# Altium project GBA.PrjPcb (part 1 of 4)
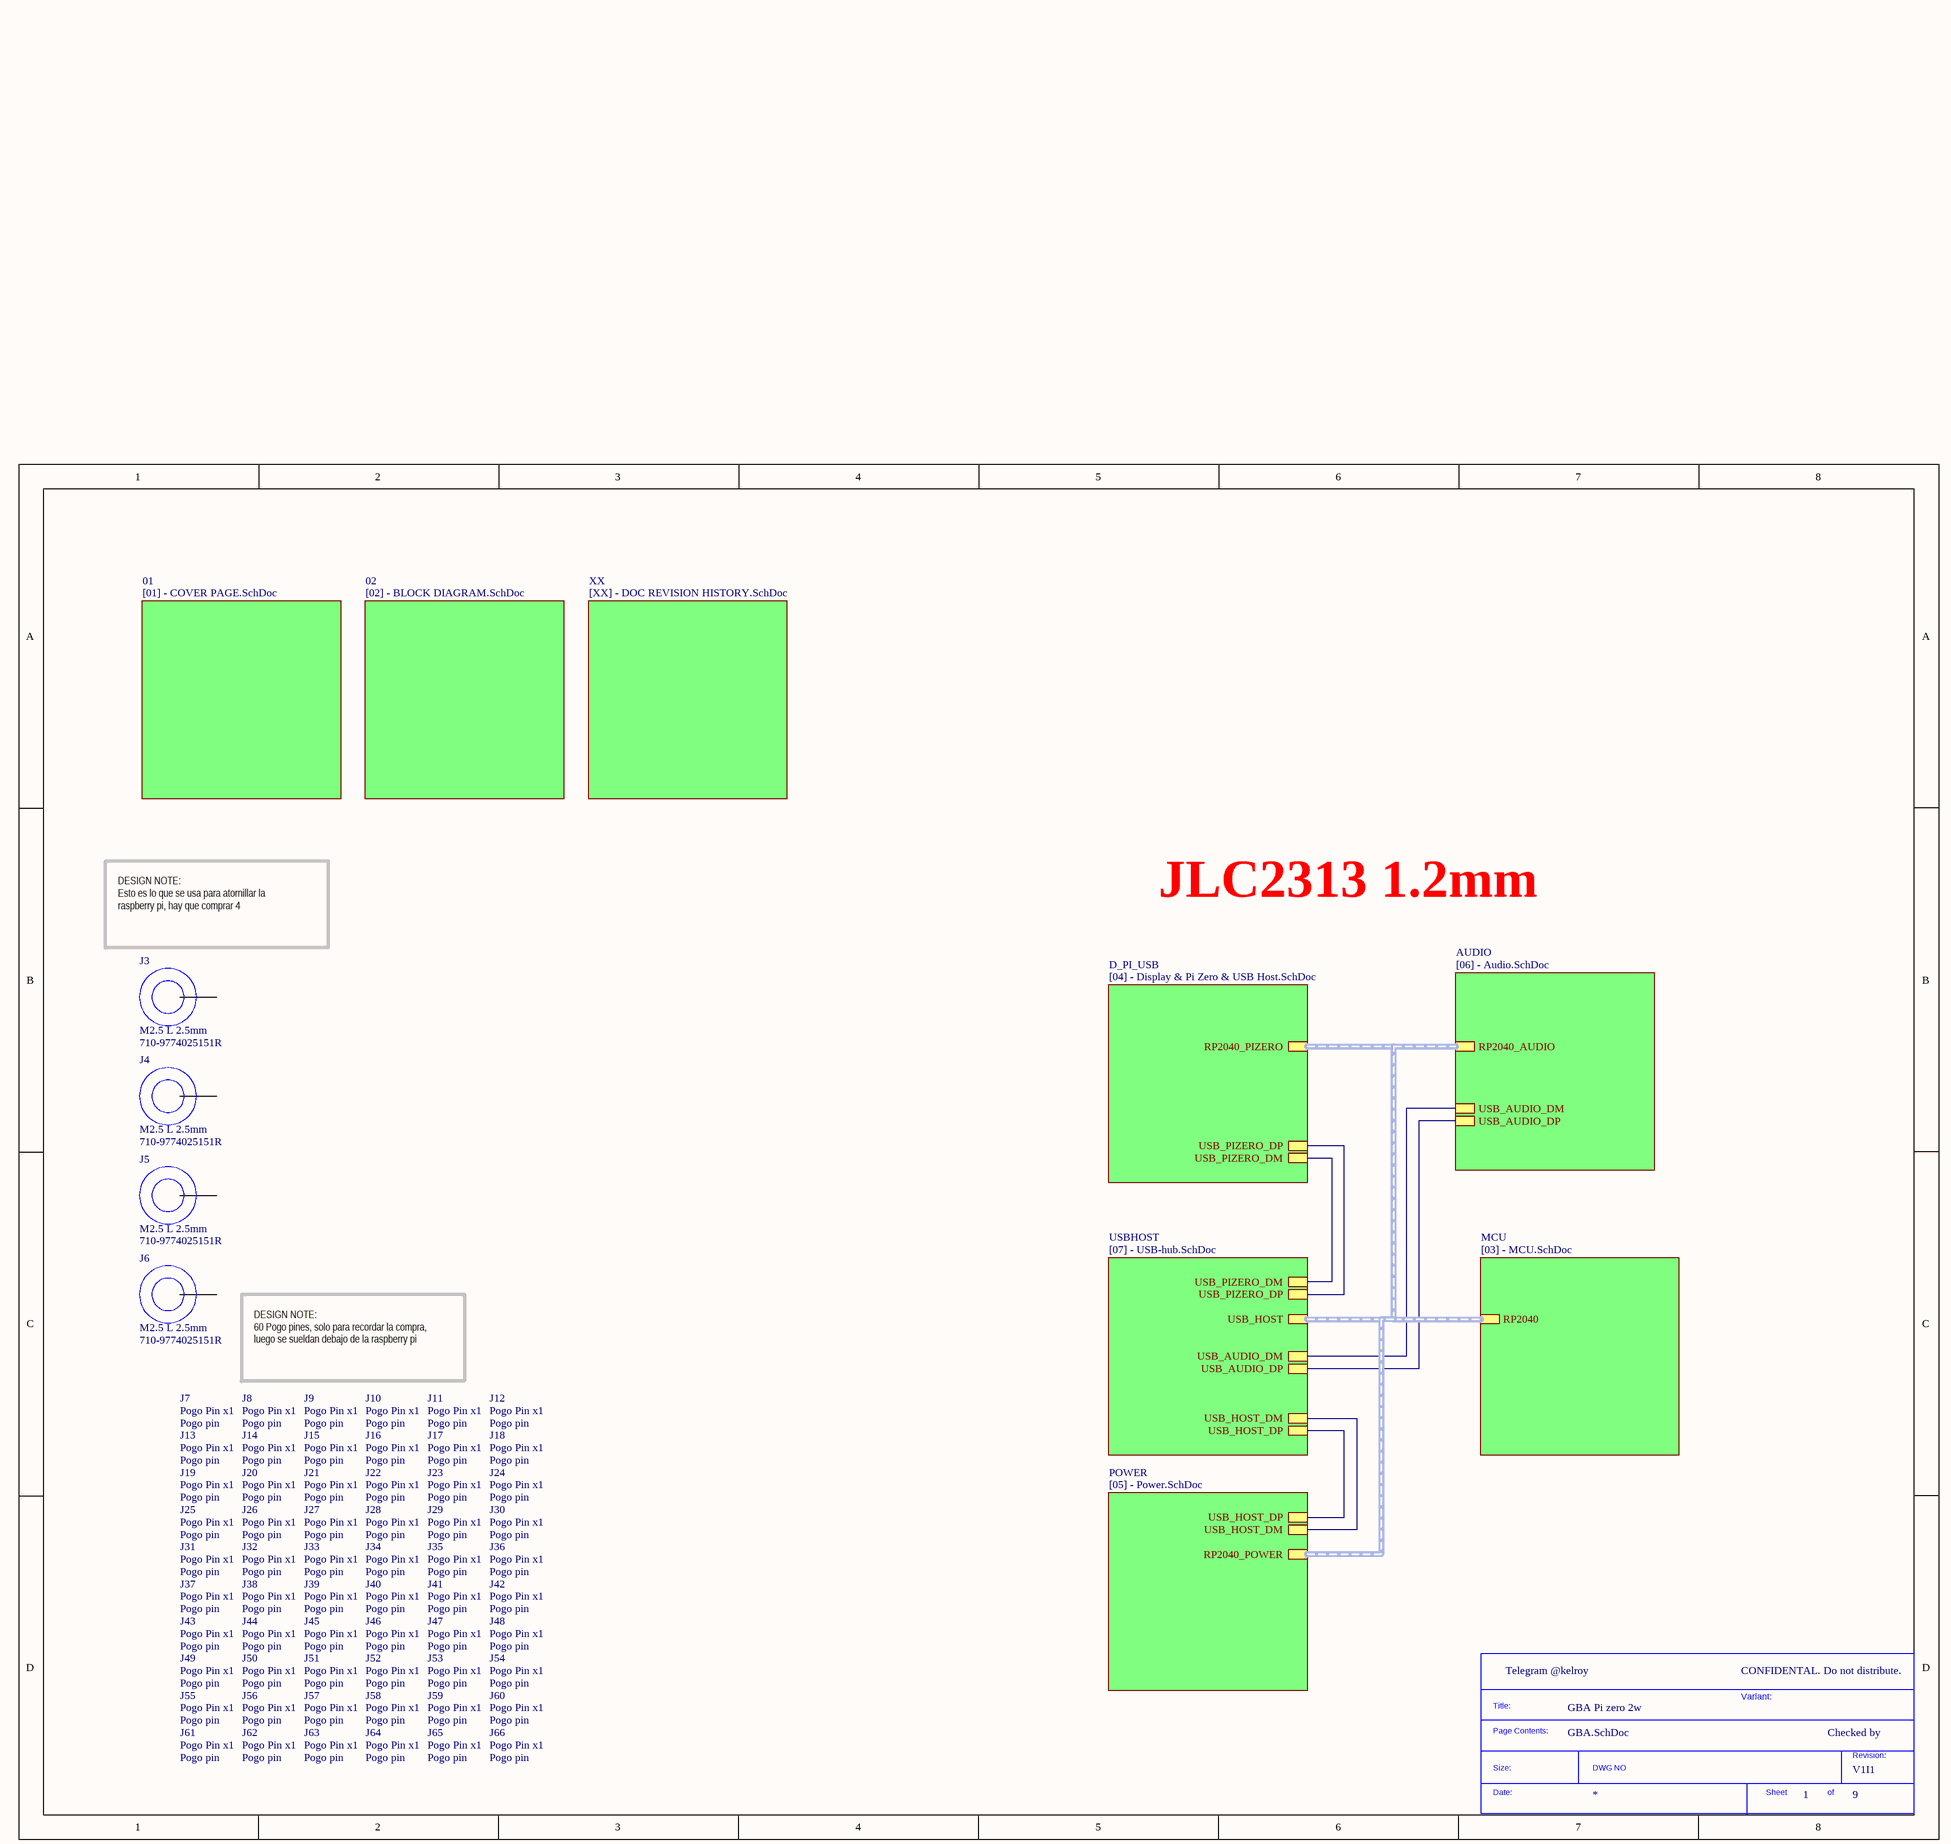
[diagram p0: GBA.SchDoc]
VersionRevision: V1I1; Project: GBA Pi zero 2w; Company: Telegram @kelroy
9 sheets, 258 parts. Net scope: hierarchical (ports join the sheet entries above them; power ports are global).
Board file: GBA_V1.PcbDoc
Sheets:
  GBA.SchDoc
    01 = [01] - COVER PAGE.SchDoc
    02 = [02] - BLOCK DIAGRAM.SchDoc
    XX = [XX] - DOC REVISION HISTORY.SchDoc
    D_PI_USB = [04] - Display & Pi Zero & USB Host.SchDoc
    USBHOST = [07] - USB-hub.SchDoc
    AUDIO = [06] - Audio.SchDoc
    MCU = [03] - MCU.SchDoc
    POWER = [05] - Power.SchDoc

## Sheet GBA.SchDoc
size A3; CompanyName: KDS; Organization: KDS; DocumentNumber: 4; Revision: V1I1; SheetNumber: 1; SheetTotal: 9; PageSetup: Record=PageOptions|CenterHorizontal=True|CenterVertical=True|PrintScale=1.07|XCorrection=1.00|YCorrection=1.00|PrintKind=1|BorderSize=5000000|LeftOffset=0|BottomOffset=0|Orientation=2|PaperLength=1000|PaperWidth=1000|Scale=100|PaperSource=7|PrintQuality=600|MediaType=1|DitherType=10|PaperKind=A3|PrintScaleMode=1; ProjectName: KDS C6A816x Module

### Parts
(Parts that share a designator on the sheet are numbered #1, #2 ... from top to bottom, then left to right.)
*#1  SDTitleBlock  (value not drawn)  (graphical)
J3  M2.5 L 2.5mm  Supplier Part Number 1: 710-9774025151R  (mechanical)
J4  M2.5 L 2.5mm  Supplier Part Number 1: 710-9774025151R  (mechanical)
J5  M2.5 L 2.5mm  Supplier Part Number 1: 710-9774025151R  (mechanical)
J6  M2.5 L 2.5mm  Supplier Part Number 1: 710-9774025151R  (mechanical)
J7  Pogo pin  (mechanical)
J8  Pogo pin  (mechanical)
J9  Pogo pin  (mechanical)
J10  Pogo pin  (mechanical)
J11  Pogo pin  (mechanical)
J12  Pogo pin  (mechanical)
J13  Pogo pin  (mechanical)
J14  Pogo pin  (mechanical)
J15  Pogo pin  (mechanical)
J16  Pogo pin  (mechanical)
J17  Pogo pin  (mechanical)
J18  Pogo pin  (mechanical)
J19  Pogo pin  (mechanical)
J20  Pogo pin  (mechanical)
J21  Pogo pin  (mechanical)
J22  Pogo pin  (mechanical)
J23  Pogo pin  (mechanical)
J24  Pogo pin  (mechanical)
J25  Pogo pin  (mechanical)
J26  Pogo pin  (mechanical)
J27  Pogo pin  (mechanical)
J28  Pogo pin  (mechanical)
J29  Pogo pin  (mechanical)
J30  Pogo pin  (mechanical)
J31  Pogo pin  (mechanical)
J32  Pogo pin  (mechanical)
J33  Pogo pin  (mechanical)
J34  Pogo pin  (mechanical)
J35  Pogo pin  (mechanical)
J36  Pogo pin  (mechanical)
J37  Pogo pin  (mechanical)
J38  Pogo pin  (mechanical)
J39  Pogo pin  (mechanical)
J40  Pogo pin  (mechanical)
J41  Pogo pin  (mechanical)
J42  Pogo pin  (mechanical)
J43  Pogo pin  (mechanical)
J44  Pogo pin  (mechanical)
J45  Pogo pin  (mechanical)
J46  Pogo pin  (mechanical)
J47  Pogo pin  (mechanical)
J48  Pogo pin  (mechanical)
J49  Pogo pin  (mechanical)
J50  Pogo pin  (mechanical)
J51  Pogo pin  (mechanical)
J52  Pogo pin  (mechanical)
J53  Pogo pin  (mechanical)
J54  Pogo pin  (mechanical)
J55  Pogo pin  (mechanical)
J56  Pogo pin  (mechanical)
J57  Pogo pin  (mechanical)
J58  Pogo pin  (mechanical)
J59  Pogo pin  (mechanical)
J60  Pogo pin  (mechanical)
J61  Pogo pin  (mechanical)
J62  Pogo pin  (mechanical)
J63  Pogo pin  (mechanical)
J64  Pogo pin  (mechanical)
J65  Pogo pin  (mechanical)
J66  Pogo pin  (mechanical)

### Sub-sheets
01 = [01] - COVER PAGE.SchDoc: no entries
02 = [02] - BLOCK DIAGRAM.SchDoc: no entries
AUDIO = [06] - Audio.SchDoc: USB_AUDIO_DM, RP2040_AUDIO (harness RP2040), USB_AUDIO_DP
D_PI_USB = [04] - Display & Pi Zero & USB Host.SchDoc: RP2040_PIZERO (harness RP2040), USB_PIZERO_DP, USB_PIZERO_DM
MCU = [03] - MCU.SchDoc: RP2040 (harness RP2040)
POWER = [05] - Power.SchDoc: RP2040_POWER (harness RP2040), USB_HOST_DM, USB_HOST_DP
USBHOST = [07] - USB-hub.SchDoc: USB_PIZERO_DM, USB_AUDIO_DP, USB_HOST_DM, USB_HOST (harness RP2040), USB_PIZERO_DP, USB_HOST_DP, USB_AUDIO_DM
XX = [XX] - DOC REVISION HISTORY.SchDoc: no entries

### Nets
POST_DR_DAC_N: sheet USBHOST/USB_AUDIO_DM, sheet AUDIO/USB_AUDIO_DM
POST_DR_DAC_P: sheet USBHOST/USB_AUDIO_DP, sheet AUDIO/USB_AUDIO_DP
RPI_USB_N: sheet D_PI_USB/USB_PIZERO_DM, sheet USBHOST/USB_PIZERO_DM
RPI_USB_P: sheet D_PI_USB/USB_PIZERO_DP, sheet USBHOST/USB_PIZERO_DP
USB_D2_N: sheet USBHOST/USB_HOST_DM, sheet POWER/USB_HOST_DM
USB_D2_P: sheet USBHOST/USB_HOST_DP, sheet POWER/USB_HOST_DP

Not connected (* = marked no-connect by the designer): J3 1; J4 1; J5 1; J6 1

### Buses and harness runs
harness sheet AUDIO/RP2040_AUDIO = sheet D_PI_USB/RP2040_PIZERO = sheet MCU/RP2040 = sheet POWER/RP2040_POWER = sheet USBHOST/USB_HOST

### Notes on the sheet
- JLC2313 1.2mm
- DESIGN NOTE:
  Esto es lo que se usa para atornillar la raspberry pi, hay que comprar 4
- DESIGN NOTE:
  60 Pogo pines, solo para recordar la compra, luego se sueldan debajo de la raspberry pi
- CONFIDENTAL. Do not distribute.
- Variant:
- Checked by
- (in symbol 0906-0-15-20-76-14-11-0) Pogo Pin x1
- (in symbol SDTitleBlock) Title:; Page Contents:; Revision:; Size:; DWG NO; Date:; Sheet; of

### Library data of the parts
J3-J6 = 9774025151R: Spacer Material: Steel Mounting: SMT Series: WA-SMSI Thread D: M2.5; Manufacturer: Wurth Electronics; Plating: Tin; Threaded/Unthreaded: Threaded; Outside Diameter: 0.201inch; Supplier 1: Mouser; Manufacturer Part Number: 9774025151R; RoHS: Yes; Category: Spacers, Standoffs; Stock 1: 24227; Pricing 1: 1=1,27000, 10=1,22000, 50=1,07000, 100=0,97900, 500=0,90700, 1000=0,90700, 10000=0,90700 (USD); Material: Steel; Length: 0.154inch; REACH SVHC: Unknown; ComponentLink1URL: http://www.farnell.com/datasheets/1960364.pdf?src-supplier=Farnell; ComponentLink1Description: http://www.farnell.com/datasheets/1960364.pdf?src-supplier=Farnell; ComponentLink2URL: http://www.mouser.com/ds/2/445/9774025151R-611453.pdf?src-supplier=Mouser; ComponentLink2Description: http://www.mouser.com/ds/2/445/9774025151R-611453.pdf?src-supplier=Mouser; ComponentLink3URL: https://media.digikey.com/pdf/Data%20Sheets/Wurth%20Electronics%20PDFs/WA-SMSx_Performance_Flyer.pdf?src-supplier=Digi-Key; ComponentLink3Description: https://media.digikey.com/pdf/Data%20Sheets/Wurth%20Electronics%20PDFs/WA-SMSx_Performance_Flyer.pdf?src-supplier=Digi-Key; ComponentLink4URL: http://www.farnell.com/datasheets/1960364.pdf?src-supplier=Element14; ComponentLink4Description: http://www.farnell.com/datasheets/1960364.pdf?src-supplier=Element14; ComponentLink5URL: http://www.farnell.com/datasheets/1960364.pdf?src-supplier=Newark; ComponentLink5Description: http://www.farnell.com/datasheets/1960364.pdf?src-supplier=Newark
J7-J66 = 0906-0-15-20-76-14-11-0: 0906 Series Spring-Loaded Pin Shell Material=Brass Alloy; Manufacturer: Mill-Max; Supplier 1: Mouser; Manufacturer Part Number: 0906-0-15-20-76-14-11-0; RoHS: Yes; Category: Connectors; Stock 1: 63461; Pricing 1: 1=0,56000, 10=0,42300, 50=0,42300, 100=0,37000, 500=0,35200, 1000=0,29000, 2500=0,25500, 10000=0,23400, 30000=0,22800, 50000=0,22000 (USD); ComponentLink1URL: https://datasheet.ciiva.com/16427/0906-0-15-20-76-14-11-0-16427148.pdf?src-supplier=Future+Electronics; ComponentLink1Description: https://datasheet.ciiva.com/16427/0906-0-15-20-76-14-11-0-16427148.pdf?src-supplier=Future+Electronics; ComponentLink2URL: https://datasheet.ciiva.com/16886/70206242-16886092.pdf?src-supplier=Allied+Electronics; ComponentLink2Description: https://datasheet.ciiva.com/16886/70206242-16886092.pdf?src-supplier=Allied+Electronics; Supplier Part Number 1: 575-906015

## Sheet [01] - COVER PAGE.SchDoc
size A3; DocumentNumber: 1; SheetNumber: 2; SheetTotal: 9
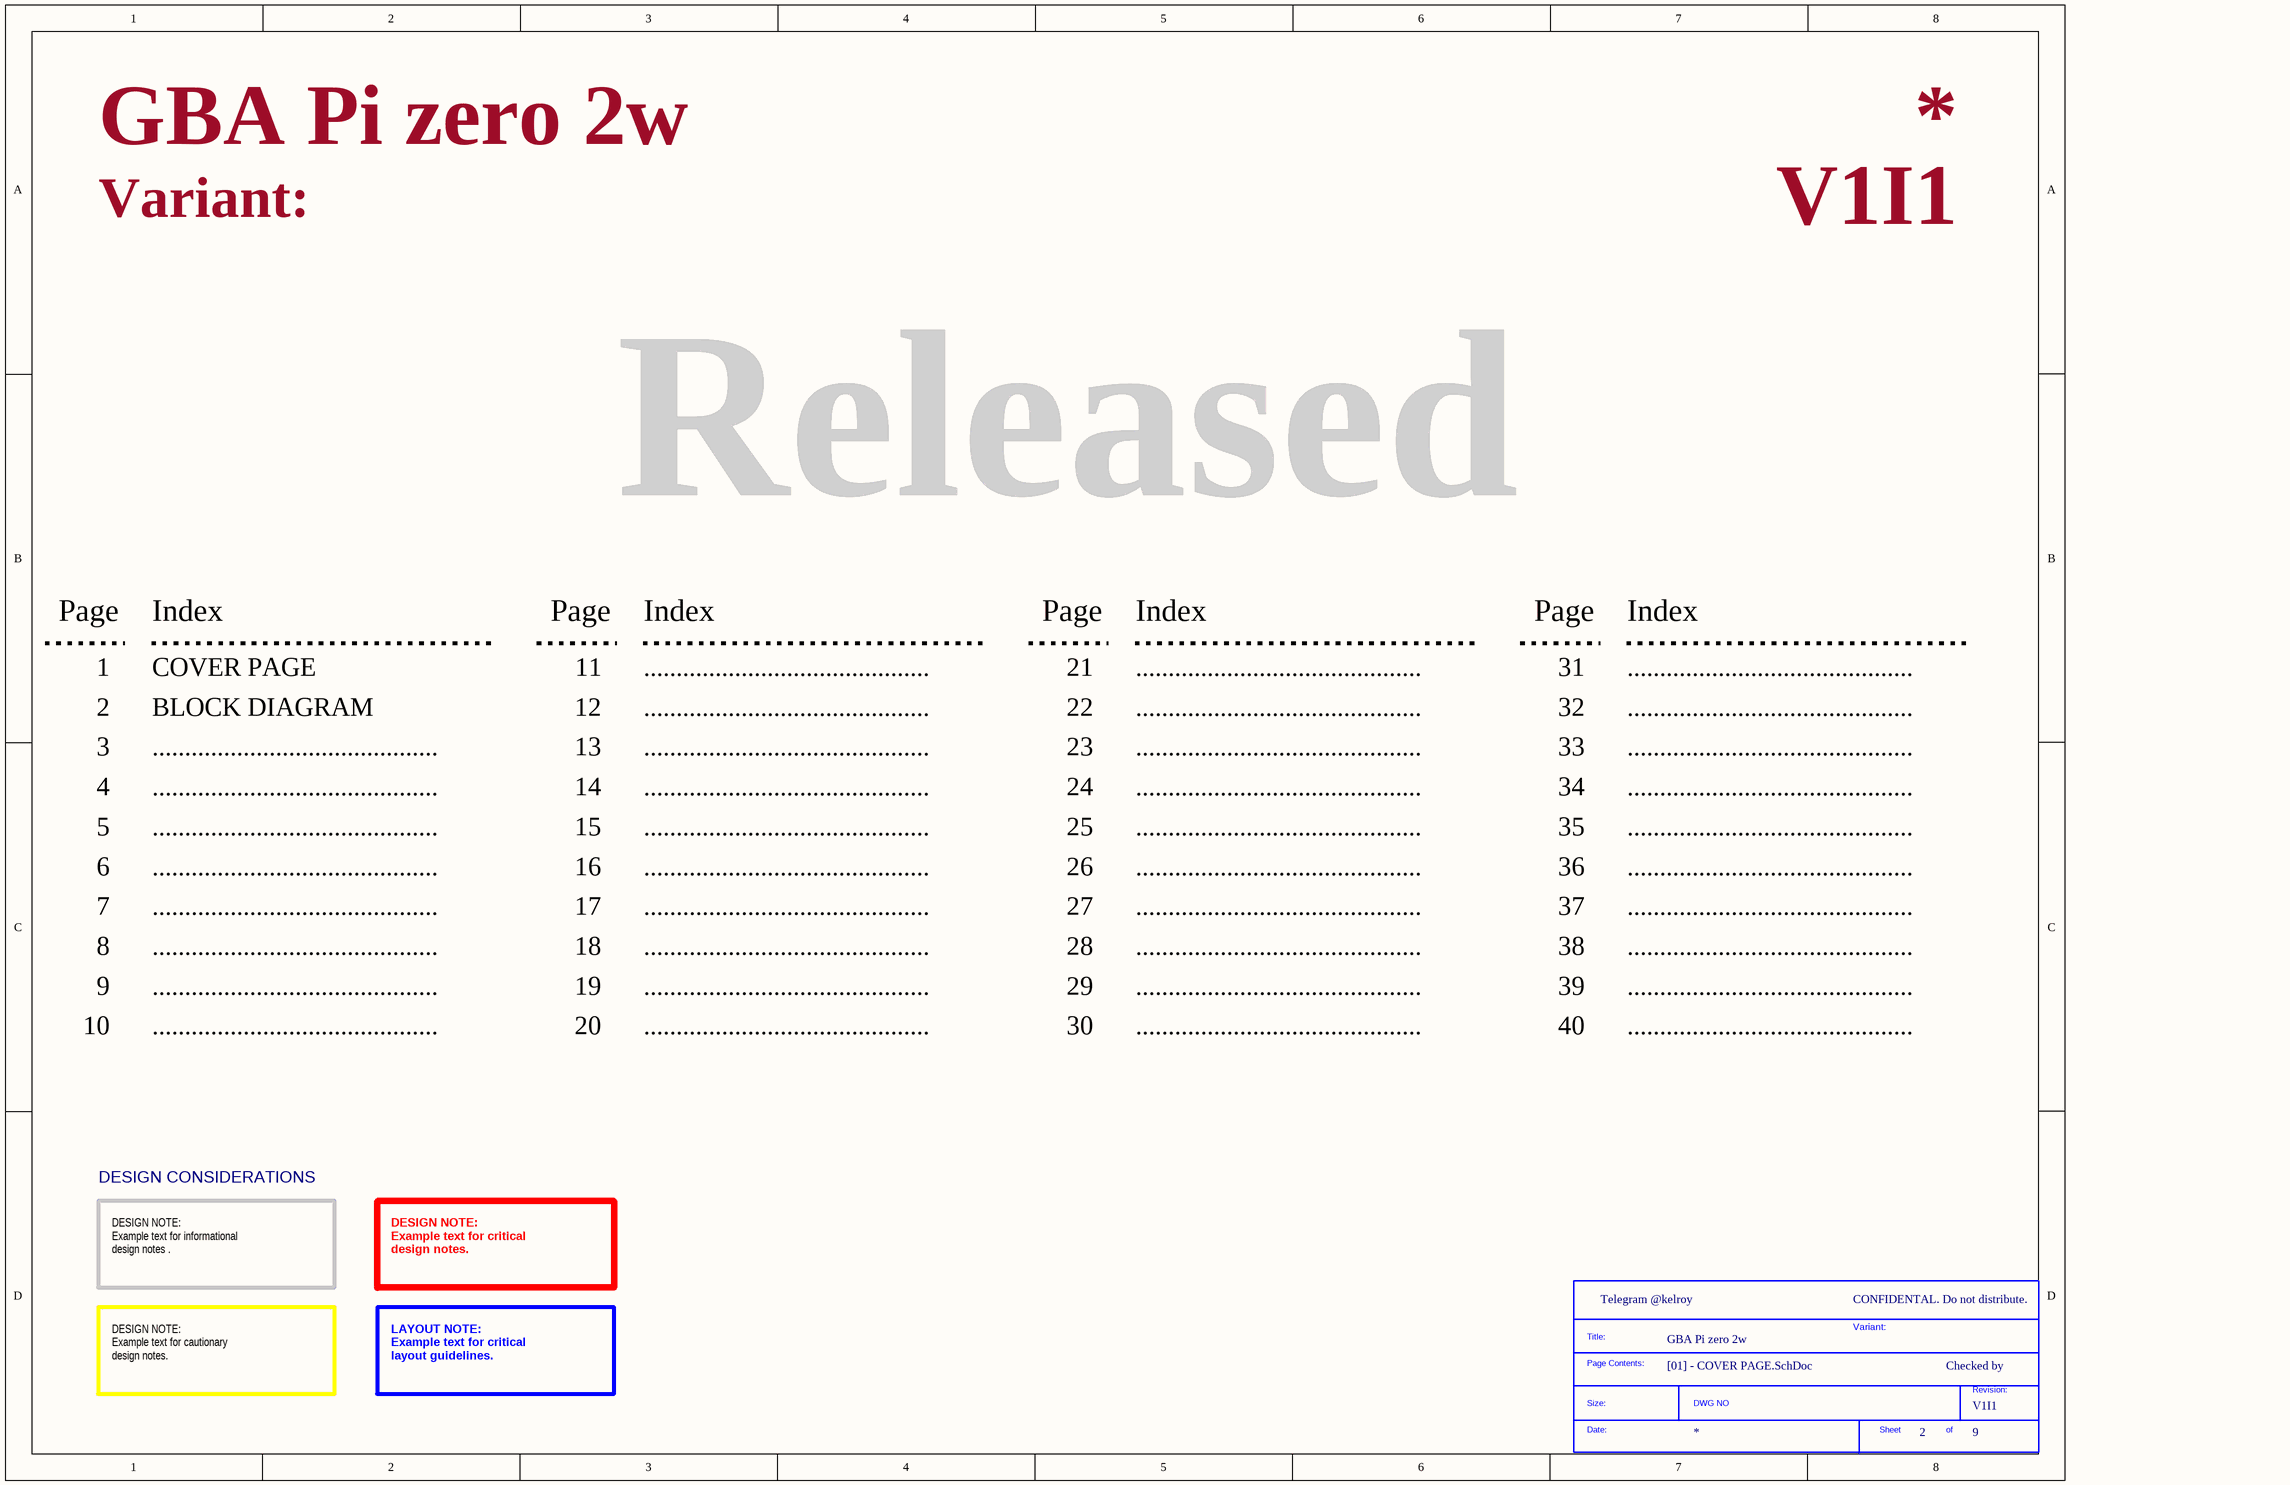
[diagram p1: [01] - COVER PAGE.SchDoc]

### Parts
(Parts that share a designator on the sheet are numbered #1, #2 ... from top to bottom, then left to right.)
*#2  SDTitleBlock  (value not drawn)  (graphical)

### Notes on the sheet
- Variant:
- Released
- Page
- Index
- 1
- COVER PAGE
- 11
- ............................................
- 21
- 31
- 2
- 3
- BLOCK DIAGRAM
- 12
- 13
- 22
- 23
- 32
- 33
- 4
- 5
- 14
- 15
- 24
- 25
- 34
- 35
- 6
- 16
- 26
- 36
- 7
- 8
- 17
- 18
- 27
- 28
- 37
- 38
- 9
- 10
- 19
- 20
- 29
- 30
- 39
- 40
- DESIGN CONSIDERATIONS
- DESIGN NOTE:
  Example text for informational
  design notes .
- DESIGN NOTE:
  Example text for critical
  design notes.
- CONFIDENTAL. Do not distribute.
- Checked by
- DESIGN NOTE:
  Example text for cautionary
  design notes.
- LAYOUT NOTE:
  Example text for critical
  layout guidelines.
- (in symbol SDTitleBlock) Title:; Page Contents:; Revision:; Size:; DWG NO; Date:; Sheet; of

## Sheet [02] - BLOCK DIAGRAM.SchDoc
size A3; DocumentNumber: 2; SheetNumber: 3; SheetTotal: 9
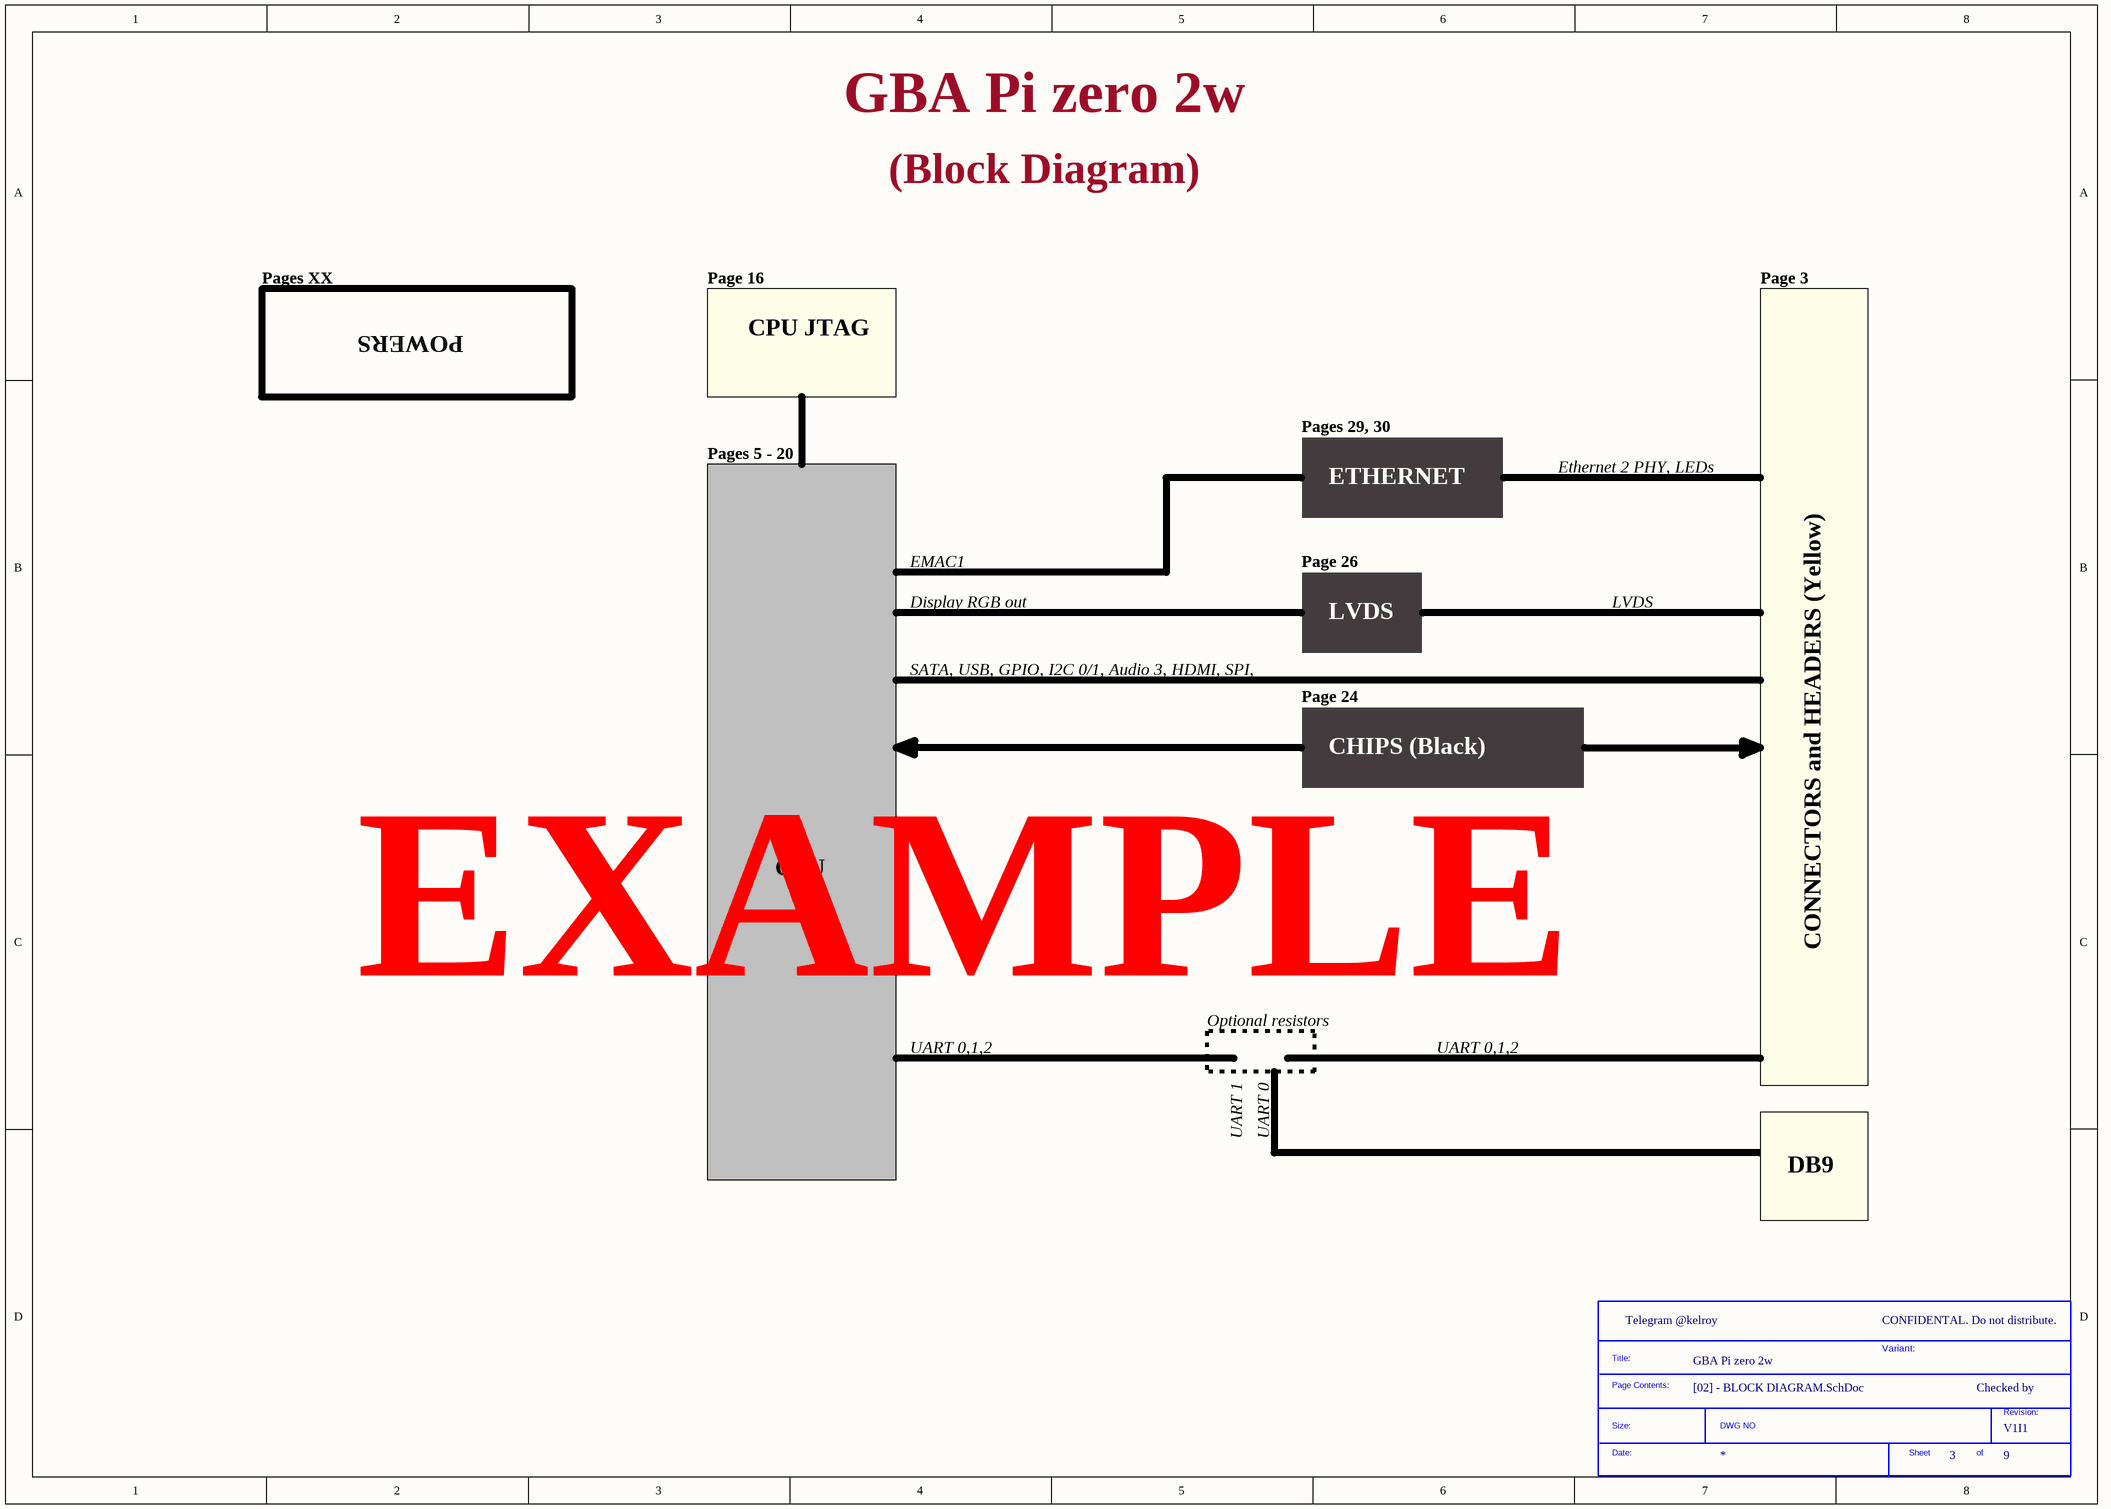
[diagram p2: [02] - BLOCK DIAGRAM.SchDoc]

### Parts
(Parts that share a designator on the sheet are numbered #1, #2 ... from top to bottom, then left to right.)
*#3  SDTitleBlock  (value not drawn)  (graphical)

### Notes on the sheet
- (Block Diagram)
- Pages XX
- Page 16
- Page 3
- POWERS
- CPU JTAG
- Pages 29, 30
- Pages 5 - 20
- ETHERNET
- Ethernet 2 PHY, LEDs
- EMAC1
- Page 26
- Display RGB out
- LVDS
- SATA, USB, GPIO, I2C 0/1, Audio 3, HDMI, SPI,
- Page 24
- CHIPS (Black)
- CPU
- CONNECTORS and HEADERS (Yellow)
- EXAMPLE
- UART 0,1,2
- Optional resistors
- FPGA
- UART 1
- UART 0
- DB9
- CONFIDENTAL. Do not distribute.
- CLOCKS (CPU & PCIE)
- Variant:
- Checked by
- (in symbol SDTitleBlock) Title:; Page Contents:; Revision:; Size:; DWG NO; Date:; Sheet; of

## Sheet [XX] - DOC REVISION HISTORY.SchDoc
size A3; DocumentNumber: 3; SheetNumber: 9; SheetTotal: 9
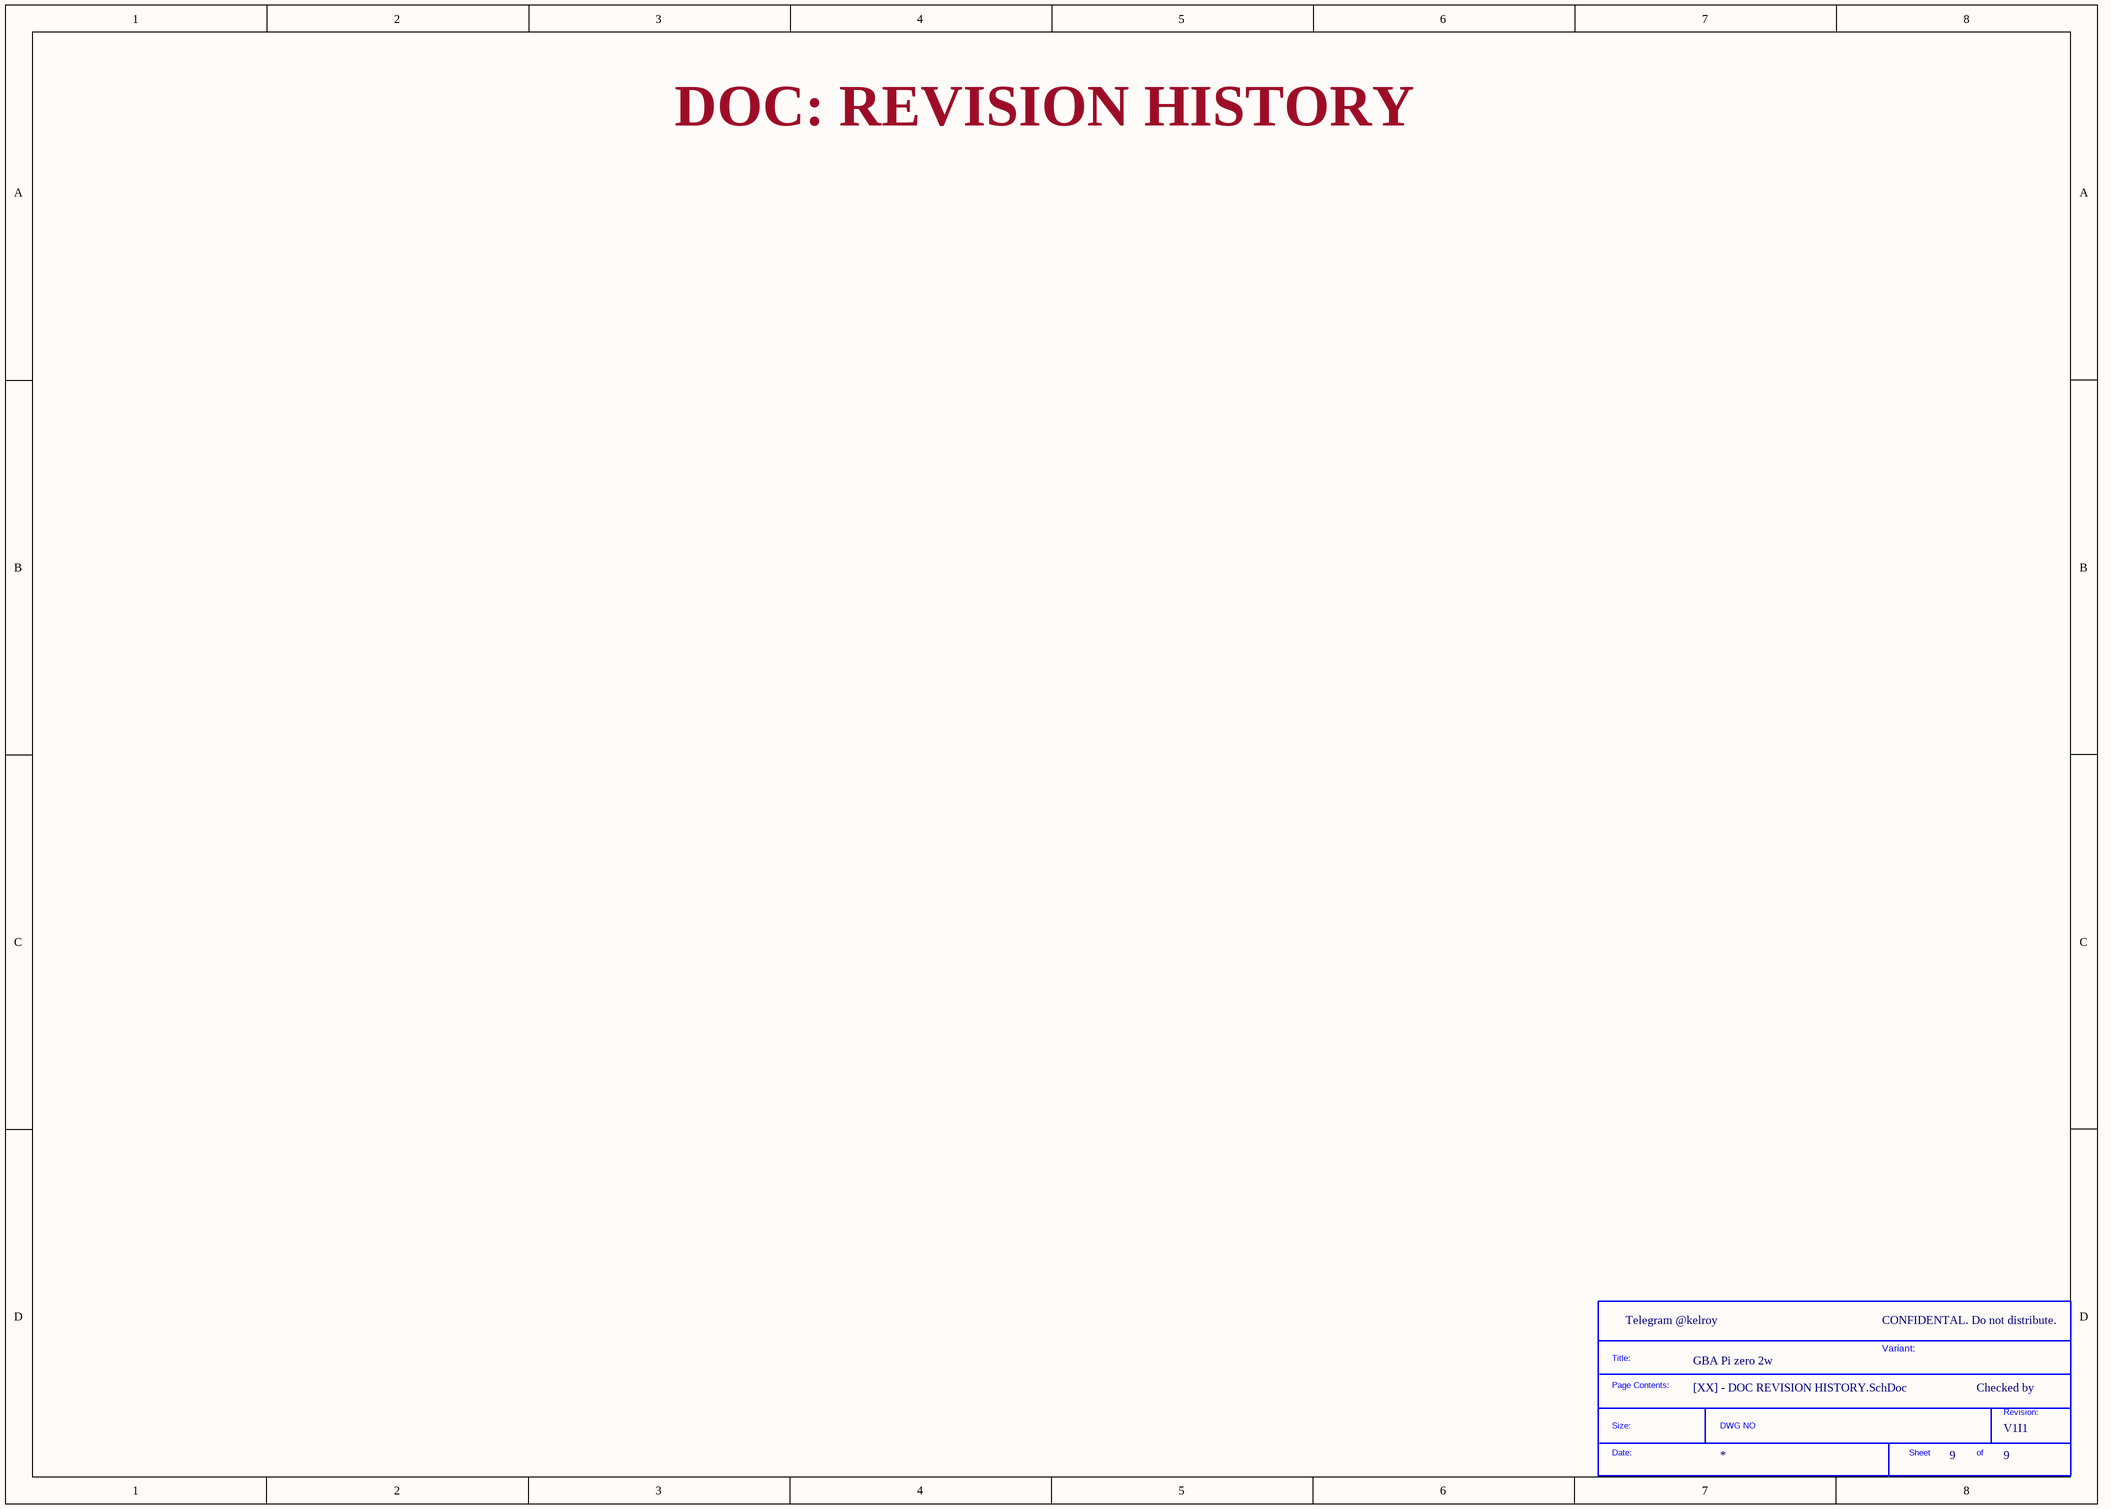
[diagram p3: [XX] - DOC REVISION HISTORY.SchDoc]

### Parts
(Parts that share a designator on the sheet are numbered #1, #2 ... from top to bottom, then left to right.)
*#4  SDTitleBlock  (value not drawn)  (graphical)

### Notes on the sheet
- DOC: REVISION HISTORY
- CONFIDENTAL. Do not distribute.
- CLOCKS (CPU & PCIE)
- Variant:
- Checked by
- (in symbol SDTitleBlock) Title:; Page Contents:; Revision:; Size:; DWG NO; Date:; Sheet; of

## Sheet [04] - Display & Pi Zero & USB Host.SchDoc
size A3; DocumentNumber: 7; SheetNumber: 6; SheetTotal: 9
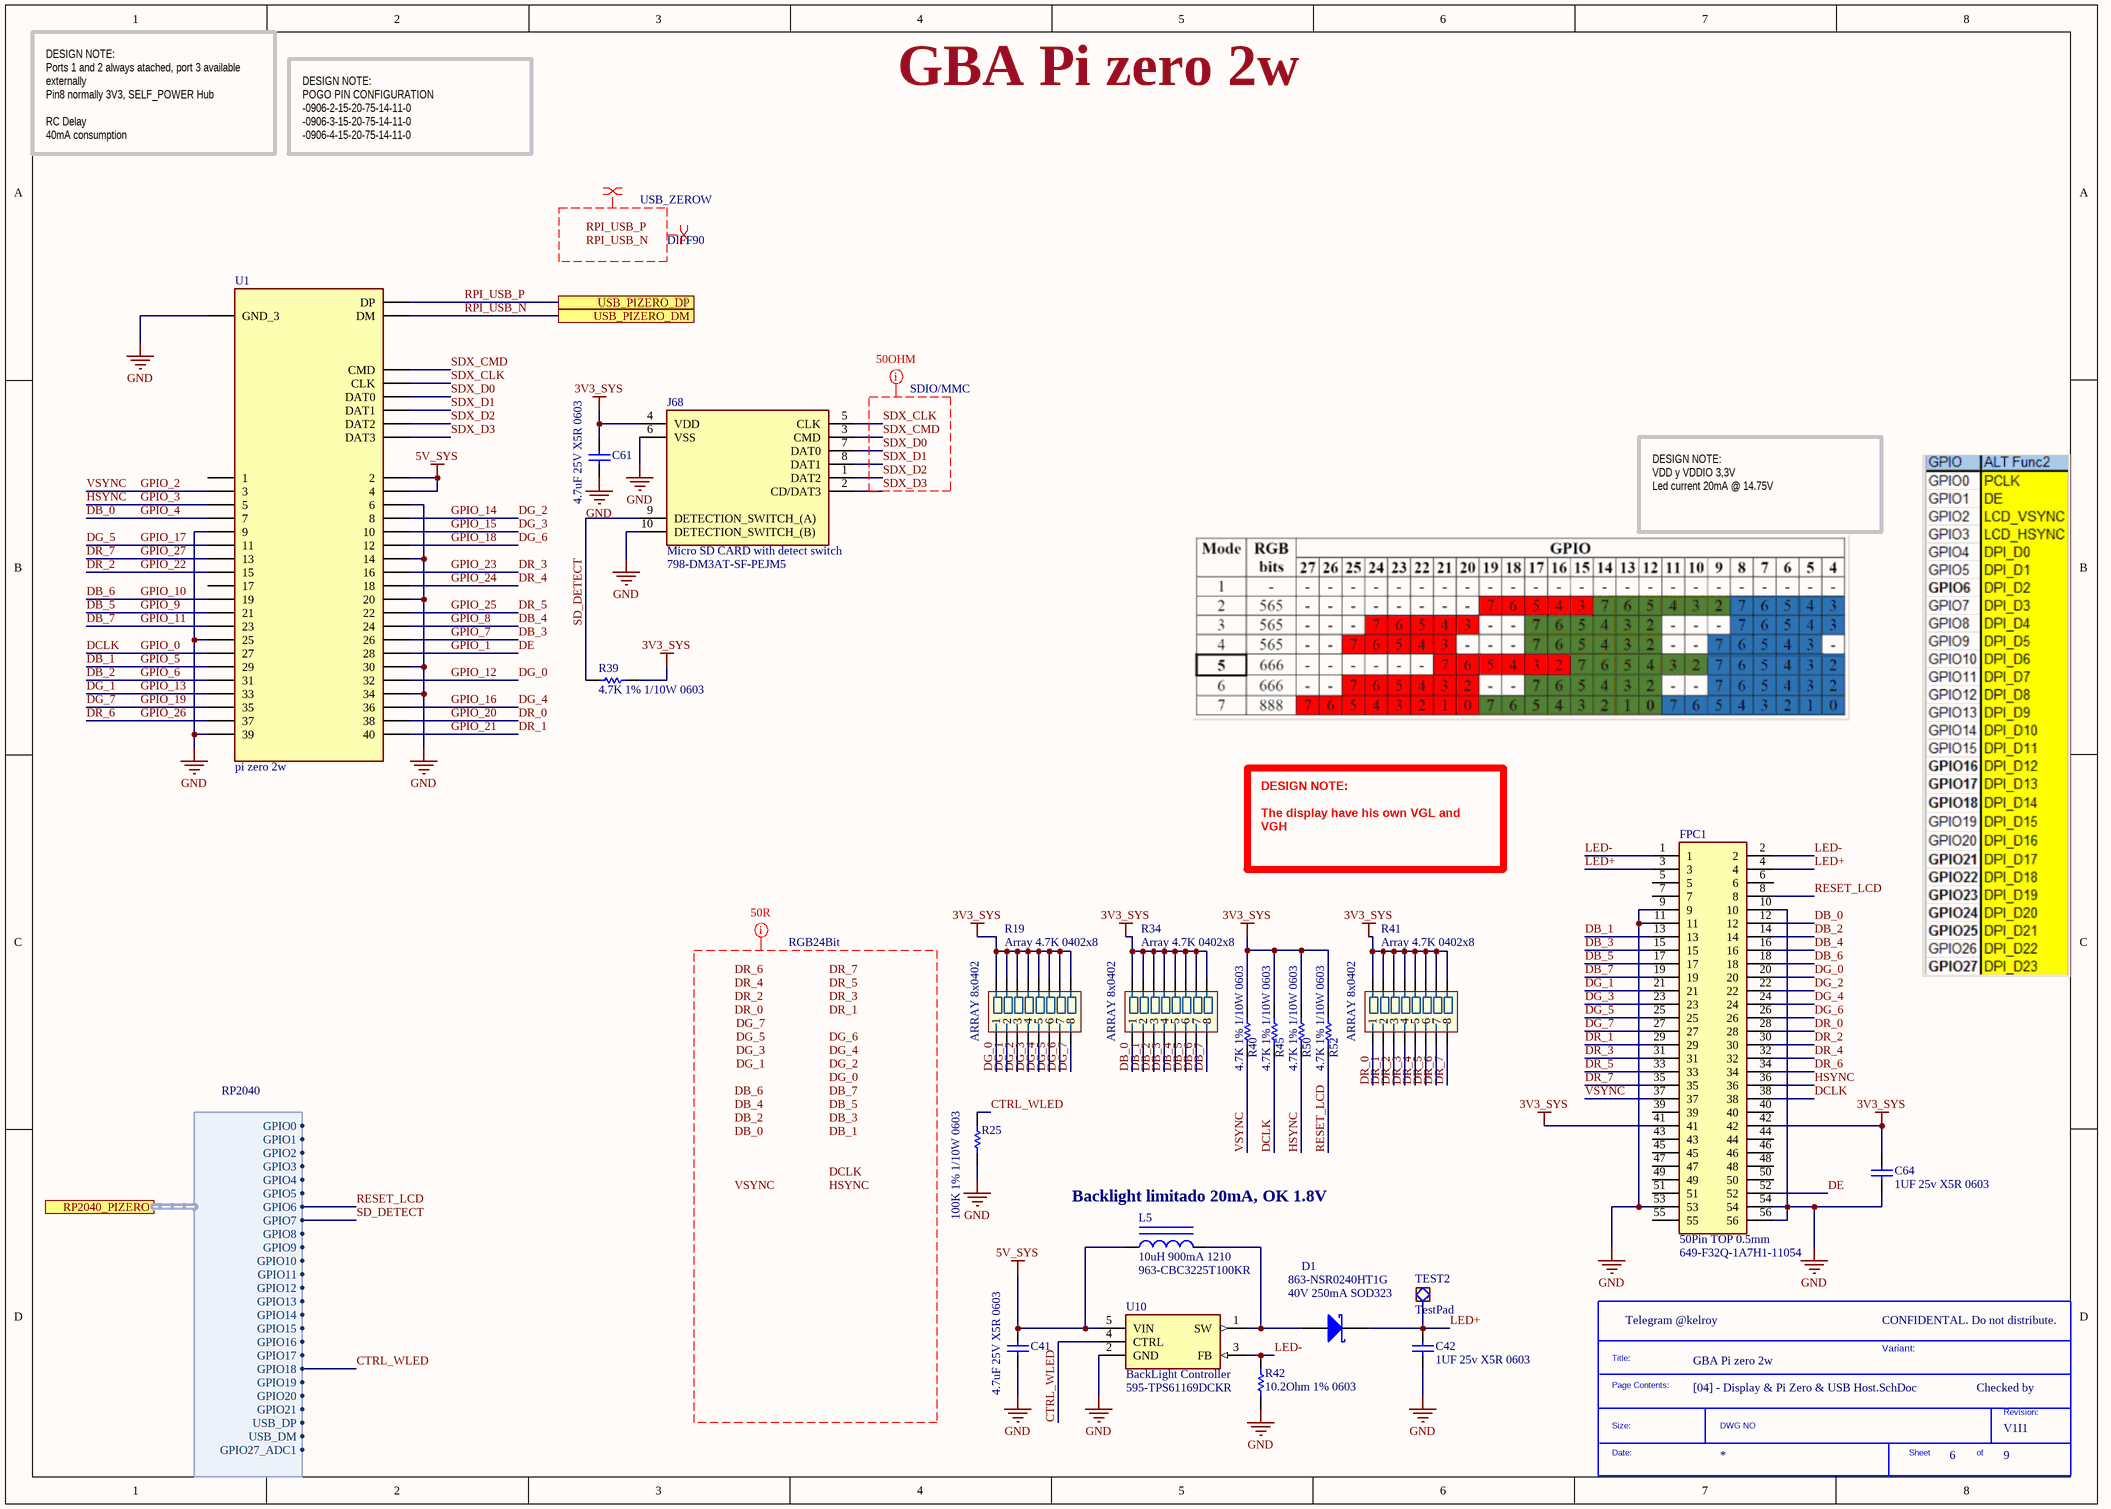
[diagram p4: [04] - Display & Pi Zero & USB Host.SchDoc]

### Parts
(Parts that share a designator on the sheet are numbered #1, #2 ... from top to bottom, then left to right.)
*#5  SDTitleBlock  (value not drawn)  (graphical)
C41  4.7uF 25V X5R 0603  [C 0603/1608]
C42  1UF 25v X5R 0603  [C 0603/1608]
C61  4.7uF 25V X5R 0603  [C 0603/1608]
C64  1UF 25v X5R 0603  [C 0603/1608]
D1  40V 250mA SOD323  Supplier Part Number 1: 863-NSR0240HT1G  [SOD-323]
FPC1  50Pin TOP 0.5mm  Supplier Part Number 1: 649-F32Q-1A7H1-11054  [XF2M54151AH]
J68  Micro SD CARD with detect switch  Supplier Part Number 1: 798-DM3AT-SF-PEJM5  [DM3AT-SF-PEJM5_1]
L5  10uH 900mA 1210  Supplier Part Number 1: 963-CBC3225T100KR  [L 1210/3225]
R19  Array 4.7K 0402x8  [YAG_YC248-M]
R25  100K 1% 1/10W 0603  [R 0603/1608]
R34  Array 4.7K 0402x8  [YAG_YC248-M]
R39  4.7K 1% 1/10W 0603  [R 0603/1608]
R40  4.7K 1% 1/10W 0603  [R 0603/1608]
R41  Array 4.7K 0402x8  [YAG_YC248-M]
R42  10.2Ohm 1% 0603  [R 0603/1608]
R45  4.7K 1% 1/10W 0603  [R 0603/1608]
R50  4.7K 1% 1/10W 0603  [R 0603/1608]
R52  4.7K 1% 1/10W 0603  [R 0603/1608]
TEST2  TestPad  [TestPad]  (no BOM)
U1  pi zero 2w  [Pi 2 Zero W - Release]
U10  BackLight Controller  Supplier Part Number 1: 595-TPS61169DCKR  [SOT65P210X110-5N]

### Ports
RP2040_PIZERO (harness RP2040), USB_PIZERO_DM, USB_PIZERO_DP

### Harnesses
RP2040: GPIO0, GPIO1, GPIO2, GPIO3, USB_DP, USB_DM, GPIO27_ADC1, GPIO4, GPIO5, GPIO6, GPIO7, GPIO8, GPIO9, GPIO10, GPIO11, GPIO12, GPIO13, GPIO14, GPIO15, GPIO16, GPIO17, GPIO18, GPIO19, GPIO20, GPIO21

### Nets
3V3_SYS: C61.1 C64.1 FPC1.41 FPC1.42 J68.4(VDD) R19.9 R19.10 R19.11 R19.12 R19.13 R19.14 R19.15 R19.16 R34.9 R34.10 R34.11 R34.12 R34.13 R34.14 R34.15 R34.16 R39.1 R40.2 R41.9 R41.10 R41.11 R41.12 R41.13 R41.14 R41.15 R41.16 R45.2 R50.2 R52.2
5V_SYS: C41.1 L5.1 U1.2 U1.4 U10.5(VIN)
GND: C41.2 C42.2 C61.2 C64.2 FPC1.9 FPC1.10 FPC1.11 FPC1.53 FPC1.54 FPC1.56 J68.6(VSS) J68.10(DETECTION_SWITCH_(B)) R25.1 R42.1 U1.6 U1.9 U1.14 U1.20 U1.25 U1.30 U1.34 U1.39 U1.GND_3 U10.2(GND)  [project net CSN]
CTRL_WLED: R25.2 U10.4(CTRL) ; port RP2040_PIZERO.GPIO18
DB_0: FPC1.12 R34.1 U1.7  [also labelled GPIO_4]
DB_1: FPC1.13 R34.2 U1.29  [also labelled GPIO_5]
DB_2: FPC1.14 R34.3 U1.31  [also labelled GPIO_6]
DB_3: FPC1.15 R34.4 U1.26  [also labelled GPIO_7]
DB_4: FPC1.16 R34.5 U1.24  [also labelled GPIO_8]
DB_5: FPC1.17 R34.6 U1.21  [also labelled GPIO_9]
DB_6: FPC1.18 R34.7 U1.19  [also labelled GPIO_10]
DB_7: FPC1.19 R34.8 U1.23  [also labelled GPIO_11]
DCLK: FPC1.38 R45.1 U1.27  [also labelled GPIO_0]
DE: FPC1.52 U1.28  [also labelled GPIO_1]
DG_0: FPC1.20 R19.1 U1.32  [also labelled GPIO_12]
DG_1: FPC1.21 R19.2 U1.33  [also labelled GPIO_13]
DG_2: FPC1.22 R19.3 U1.8  [also labelled GPIO_14]
DG_3: FPC1.23 R19.4 U1.10  [also labelled GPIO_15]
DG_4: FPC1.24 R19.5 U1.36  [also labelled GPIO_16]
DG_5: FPC1.25 R19.6 U1.11  [also labelled GPIO_17]
DG_6: FPC1.26 R19.7 U1.12  [also labelled GPIO_18]
DG_7: FPC1.27 R19.8 U1.35  [also labelled GPIO_19]
DR_0: FPC1.28 R41.1 U1.38  [also labelled GPIO_20]
DR_1: FPC1.29 R41.2 U1.40  [also labelled GPIO_21]
DR_2: FPC1.30 R41.3 U1.15  [also labelled GPIO_22]
DR_3: FPC1.31 R41.4 U1.16  [also labelled GPIO_23]
DR_4: FPC1.32 R41.5 U1.18  [also labelled GPIO_24]
DR_5: FPC1.33 R41.6 U1.22  [also labelled GPIO_25]
DR_6: FPC1.34 R41.7 U1.37  [also labelled GPIO_26]
DR_7: FPC1.35 R41.8 U1.13  [also labelled GPIO_27]
GPIO_2: FPC1.37 R40.1 U1.3  [also labelled VSYNC]
GPIO_3: FPC1.36 R50.1 U1.5  [also labelled HSYNC]
LED+: C42.1 D1.1(K) FPC1.3 FPC1.4 TEST2.1
LED-: FPC1.1 FPC1.2 R42.2 U10.3(FB)
RESET_LCD: FPC1.8 R52.1 ; port RP2040_PIZERO.GPIO6
RPI_USB_N: U1.DM ; port USB_PIZERO_DM
RPI_USB_P: U1.DP ; port USB_PIZERO_DP
SD_DETECT: J68.9(DETECTION_SWITCH_(A)) R39.2 ; port RP2040_PIZERO.GPIO7  [project net RPI_GPIO7]
SDX_CLK: J68.5(CLK) U1.CLK
SDX_CMD: J68.3(CMD) U1.CMD
SDX_D0: J68.7(DAT0) U1.DAT0
SDX_D1: J68.8(DAT1) U1.DAT1
SDX_D2: J68.1(DAT2) U1.DAT2
SDX_D3: J68.2(CD/DAT3) U1.DAT3
NetD1_2: D1.2(A) L5.2 U10.1(SW)

Not connected (* = marked no-connect by the designer): FPC1 5 6 7 39 40 43 44 45 46 47 48 49 50 51 55; U1 1 17

### Layout directives
net class USB_ZEROW; rule Differential Pairs Routing [Pref Gap = 0.18mm    Min Gap  = 0.18mm    Max Gap  = 0.18mmPref Width = 0.15mm    Min Width  = 0.15mm    Max Width  = 0.15mm]: RPI_USB_N, RPI_USB_P
differential pair; net class DIFF90: RPI_USB_N, RPI_USB_P
net class RGB24Bit; rule Width Constraint [Pref Width = 0.18mm    Min Width = 0.18mm    Max Width = 0.18mm]: DB_0, DB_1, DB_2, DB_3, DB_4, DB_5, DB_6, DB_7, DCLK, DG_0, DG_1, DG_2, DG_3, DG_4, DG_5, DG_6, DG_7, DR_0, DR_1, DR_2, DR_3, DR_4, DR_5, DR_6, DR_7, HSYNC, VSYNC
net class SDIO/MMC; rule Width Constraint [Pref Width = 0.18mm    Min Width = 0.18mm    Max Width = 0.18mm]: SDX_CLK, SDX_CMD, SDX_D0, SDX_D1, SDX_D2, SDX_D3

### Notes on the sheet
- DESIGN NOTE:
  Ports 1 and 2 always atached, port 3 available externally
  Pin8 normally 3V3, SELF_POWER Hub
  RC Delay
  40mA consumption
- DESIGN NOTE:
  POGO PIN CONFIGURATION
  -0906-2-15-20-75-14-11-0
  -0906-3-15-20-75-14-11-0
  -0906-4-15-20-75-14-11-0
- DESIGN NOTE:
  VDD y VDDIO 3,3V
  Led current 20mA @ 14.75V
- DESIGN NOTE:
  The display have his own VGL and VGH
- (near L5) Backlight limitado 20mA, OK 1.8V
- CONFIDENTAL. Do not distribute.
- Variant:
- Checked by
- Labels drawn without touching a wire or pin: DB_0, DB_1, DB_2, DB_3, DB_4, DB_5, DB_6, DB_7, DCLK, DG_0, DG_1, DG_2, DG_3, DG_4, DG_5, DG_6, DG_7, DR_0, DR_1, DR_2, DR_3, DR_4, DR_5, DR_6, DR_7, HSYNC, RPI_USB_N, RPI_USB_P, VSYNC
- (in symbol SDTitleBlock) Title:; Page Contents:; Revision:; Size:; DWG NO; Date:; Sheet; of
- (in symbol YC248-JR-074K7L) ARRAY 8x0402

### Library data of the parts
C41 C61 = TMK107BBJ475MA-T: Condensadores de cerámica multicapa (MLCC- SMD/SMT) 0603 25VDC 4.7uF 20% X5R; Manufacturer 1: Taiyo Yuden; Supplier 1: Mouser; Manufacturer Part Number 1: TMK107BBJ475MA-T; Stock 1: 7442; Pricing 1: 1=0.31000, 10=0.15200, 50=0.15200, 100=0.10900, 1000=0.08300, 10000=0.06500 (USD); RoHS: No; Supplier Part Number 1: 963-TMK107BBJ475MA-T
C42 C64 = CC0603KRX5R8BB105: CAP CER 1UF 25V X5R 0603; Manufacturer: Yageo; Tolerance: 10%; Supplier 1: Mouser; Manufacturer Part Number: CC0603KRX5R8BB105; RoHS: Yes; Stock 1: 9567246; Pricing 1: 1 = 0,10000, 10 = 0,04700, 50 = 0,04700, 100 = 0,01700, 1000 = 0,01600, 10000 = 0,00800 (USD); Mount: Surface Mount; Case/Package: 0603; Number of Pins: 2; Case Code (Metric): 1608; Case Code (Imperial): 0603; Min Operating Temperature: -55°C; Max Operating Temperature: 85°C; Package Quantity: 1; Capacitance: 1uF; Voltage Rating: 25V; Packaging: Tape and Reel; Dielectric: X5R; Termination: SMD/SMT; Voltage Rating (DC): 25V; Length: 1.6mm; Height: 0.8mm; Width: 0.031inch; Thickness: 0.035inch; Depth: 0.8mm; Radiation Hardening: No; REACH SVHC: No SVHC; Lead Free: Lead Free; Halogen Free: Halogen Free; ComponentLink1URL: https://datasheet.ciiva.com/176/mlccorderingcode-176785.pdf?src-supplier=Digi-Key; ComponentLink1Description: https://datasheet.ciiva.com/176/mlccorderingcode-176785.pdf?src-supplier=Digi-Key; ComponentLink2URL: https://datasheet.ciiva.com/176/mlccorderingcode-176786.pdf?src-supplier=Digi-Key; ComponentLink2Description: https://datasheet.ciiva.com/176/mlccorderingcode-176786.pdf?src-supplier=Digi-Key; ComponentLink3URL: https://datasheet.ciiva.com/176/mlccorderingcode-176787.pdf?src-supplier=Digi-Key; ComponentLink3Description: https://datasheet.ciiva.com/176/mlccorderingcode-176787.pdf?src-supplier=Digi-Key; ComponentLink4URL: https://datasheet.ciiva.com/17436/upy-gphc-x5r-4v-to-50v-12-17436952.pdf?src-supplier=Avnet+Europe; ComponentLink4Description: https://datasheet.ciiva.com/17436/upy-gphc-x5r-4v-to-50v-12-17436952.pdf?src-supplier=Avnet+Europe; ComponentLink5URL: https://datasheet.ciiva.com/7978/1525783-7978171.pdf?src-supplier=Element14; ComponentLink5Description: https://datasheet.ciiva.com/7978/1525783-7978171.pdf?src-supplier=Element14; ComponentLink6URL: https://datasheet.ciiva.com/11586/upy-gphc-x5r-4v-to-50v-12-11586318.pdf?src-supplier=Avnet; ComponentLink6Description: https://datasheet.ciiva.com/11586/upy-gphc-x5r-4v-to-50v-12-11586318.pdf?src-supplier=Avnet; Supplier Part Number 1: 603-CC603KRX5R8BB105
D1 = NSR0240HT1G: DIODE SCHOTTKY 40V 250MA SOD323; Manufacturer: ON Semiconductor; Max Surge Current: 1A; Recovery Time: 3ns; Peak Reverse Current: 10uA; Forward Voltage: 710mV; Power Dissipation: 270mW; Element Configuration: Single; Supplier 1: Mouser; Manufacturer Part Number: NSR0240HT1G; RoHS: Yes; Stock 1: 30582; Pricing 1: 1 = 0,23000, 10 = 0,15400, 50 = 0,15400, 100 = 0,06500, 1000 = 0,04400, 10000 = 0,03000 (USD); Case/Package: SOD-323-2; Number of Pins: 2; Contact Plating: Tin; Min Operating Temperature: -55°C; Max Operating Temperature: 150°C; Package Quantity: 1; Forward Current: 250mA; Packaging: Tape and Reel; Max Reverse Leakage Current: 10uA; Average Rectified Current: 250mA; Reverse Recovery Time: 3ns; Max Repetitive Reverse Voltage (Vrrm): 40V; Peak Non-Repetitive Surge Current: 1A; Max Forward Surge Current (Ifsm): 1A; Max Reverse Voltage (DC): 40V; Length: 1.8mm; Height: 1mm; Width: 1.35mm; Radiation Hardening: No; REACH SVHC: No SVHC; Lead Free: Lead Free; ComponentLink1URL: https://datasheet.ciiva.com/4714/nsr0240h-d-113658-4714368.pdf?src-supplier=Mouser; ComponentLink1Description: https://datasheet.ciiva.com/4714/nsr0240h-d-113658-4714368.pdf?src-supplier=Mouser; ComponentLink2URL: https://datasheet.ciiva.com/8293/nsr0240h-d-8293840.pdf?src-supplier=Avnet; ComponentLink2Description: https://datasheet.ciiva.com/8293/nsr0240h-d-8293840.pdf?src-supplier=Avnet; ComponentLink3URL: https://datasheet.ciiva.com/25949/nsr0240h-d-25949637.pdf?src-supplier=Avnet+Europe; ComponentLink3Description: https://datasheet.ciiva.com/25949/nsr0240h-d-25949637.pdf?src-supplier=Avnet+Europe; ComponentLink4URL: https://datasheet.ciiva.com/915/nsr0240h-d-915416.pdf?src-supplier=Digi-Key; ComponentLink4Description: https://datasheet.ciiva.com/915/nsr0240h-d-915416.pdf?src-supplier=Digi-Key; ComponentLink5URL: https://datasheet.ciiva.com/915/nsr0240h-d-915417.pdf?src-supplier=Digi-Key; ComponentLink5Description: https://datasheet.ciiva.com/915/nsr0240h-d-915417.pdf?src-supplier=Digi-Key; ComponentLink6URL: https://datasheet.ciiva.com/16396/nsr0240h-d-16396521.pdf?src-supplier=Future+Electronics; ComponentLink6Description: https://datasheet.ciiva.com/16396/nsr0240h-d-16396521.pdf?src-supplier=Future+Electronics; ComponentLink7URL: https://datasheet.ciiva.com/915/nsr0240h-d-915418.pdf?src-supplier=Digi-Key; ComponentLink7Description: https://datasheet.ciiva.com/915/nsr0240h-d-915418.pdf?src-supplier=Digi-Key; ComponentLink8URL: https://datasheet.ciiva.com/7963/nsr0240h-d-7963165.pdf?src-supplier=Element14; ComponentLink8Description: https://datasheet.ciiva.com/7963/nsr0240h-d-7963165.pdf?src-supplier=Element14
FPC1 = F32Q-1A7H1-11054: FPC/FFC Connector Socket 54 Position 0.5mm Top Contact Solder Right Angle Surface Mount T/R; Manufacturer: Amphenol ICC / FCI; Supplier 1: Mouser; Manufacturer Part Number: F32Q-1A7H1-11054; RoHS: No; Category: FFC / FPC; Stock 1: 5116; Pricing 1: 1=1,34, 10=1,06, 50=1,06, 100=0,919, 1000=0,627, 10000=0,597 (USD)
J68 = DM3AT-SF-PEJM5: CONN MICRO SD CARD PUSH-PUSH R/A; Manufacturer 1: Hirose; Connector Type: Connector; Number of Contacts: 8; Current Rating: 500mA; Voltage Rating: 125V; Gender: Female; Pitch: 1.1mm; Supplier 1: Mouser; Manufacturer Part Number 1: DM3AT-SF-PEJM5; RoHS: Yes; Category: Card Edge Connectors; Stock 1: 5089; Pricing 1: 1=2,61000, 10=2,32000, 25=2,13000, 100=2,03000, 250=1,84000, 500=1,69000 (USD); Mount: Surface Mount,Standard; Contact Plating: Gold; Contact Material: Copper Alloy; Housing Material: Polymer; Min Operating Temperature: -25°C; Max Operating Temperature: 85°C; Packaging: Tape and Reel; Number of Rows: 1; Package Quantity: 1; Orientation: Right Angle; Termination: SMD/SMT; Max Current Rating: 500mA; Max Voltage Rating (AC): 125V; Number of Positions: 8; Length: 15.95mm; Height: 1.68mm; Width: 13.85mm; Depth: 15.95mm; Radiation Hardening: No; Flammability Rating: UL94 V-0; REACH SVHC: No SVHC; Lead Free: Lead Free; ComponentLink1URL: https://datasheet.ciiva.com/683/e60900232-683393.pdf?src-supplier=Digi-Key; ComponentLink1Description: https://datasheet.ciiva.com/683/e60900232-683393.pdf?src-supplier=Digi-Key; ComponentLink2URL: https://datasheet.ciiva.com/683/e60900232-683394.pdf?src-supplier=Digi-Key; ComponentLink2Description: https://datasheet.ciiva.com/683/e60900232-683394.pdf?src-supplier=Digi-Key; ComponentLink3URL: https://datasheet.ciiva.com/683/e60900232-683395.pdf?src-supplier=Digi-Key; ComponentLink3Description: https://datasheet.ciiva.com/683/e60900232-683395.pdf?src-supplier=Digi-Key; ComponentLink4URL: https://datasheet.ciiva.com/46418/1697167-46418261.pdf?src-supplier=Element14; ComponentLink4Description: https://datasheet.ciiva.com/46418/1697167-46418261.pdf?src-supplier=Element14; ComponentLink5URL: https://datasheet.ciiva.com/3122/e60900232-3122534.pdf?src-supplier=Avnet; ComponentLink5Description: https://datasheet.ciiva.com/3122/e60900232-3122534.pdf?src-supplier=Avnet; ComponentLink6URL: https://datasheet.ciiva.com/46418/1697167-46418262.pdf?src-supplier=Element14; ComponentLink6Description: https://datasheet.ciiva.com/46418/1697167-46418262.pdf?src-supplier=Element14; ComponentLink7URL: https://datasheet.ciiva.com/16205/e60900232-16205727.pdf?src-supplier=Future+Electronics; ComponentLink7Description: https://datasheet.ciiva.com/16205/e60900232-16205727.pdf?src-supplier=Future+Electronics
L5 = CBC3225T100KR: Fixed Inductors 1210 10uH 172.9mOhms +/-10% 900mA HiCur; Manufacturer: Taiyo Yuden; Core Material: Ferrite; Self Resonant Frequency: 23MHz; Tolerance: 10%; DC Resistance (DCR): 133mR; Shielding: Unshielded; Test Frequency: 100kHz; Supplier 1: Mouser; Manufacturer Part Number: CBC3225T100KR; RoHS: Yes; Stock 1: 98328; Pricing 1: 1 = 0,25000, 10 = 0,22100, 50 = 0,22100, 100 = 0,15200, 1000 = 0,10200, 10000 = 0,07700 (USD); Mount: Surface Mount; Case/Package: 1210; Case Code (Metric): 3225; Case Code (Imperial): 1210; Min Operating Temperature: -40°C; Max Operating Temperature: 105°C; Inductance: 10uH; Packaging: Tape and Reel; Max DC Current: 900mA; Package Quantity: 1000; Current Rating: 900mA; Saturation Current: 900mA; Termination: SMD/SMT; Composition: Wirewound; Inductance Tolerance: 10%; DC Current: 900mA; Military Standard: Not; Length: 0.126inch; Height: 2.5mm; Width: 2.5mm; Height - Seated (Max): 0.106inch; Depth: 2.7mm; Radiation Hardening: No; Lead Free: Lead Free; REACH SVHC: Unknown; Halogen Free: Halogen Free; ComponentLink1URL: https://datasheet.ciiva.com/26871/getdatasheetpartid-637483-26871170.pdf?src-supplier=Verical; ComponentLink1Description: https://datasheet.ciiva.com/26871/getdatasheetpartid-637483-26871170.pdf?src-supplier=Verical; ComponentLink2URL: https://datasheet.ciiva.com/6701/cbc3225t100kr-ss-6701092.pdf?src-supplier=Digi-Key; ComponentLink2Description: https://datasheet.ciiva.com/6701/cbc3225t100kr-ss-6701092.pdf?src-supplier=Digi-Key
R19 R34 R41 = YC248-JR-074K7L: RES ARRAY 8 RES 4.7K OHM 1606; Manufacturer 1: Yageo; Resistance: 4.7kR; Number of Resistors: 8; Temperature Coefficient: 200ppm/°C; Tolerance: 5%; Voltage Rating: 50V; Circuit Type: Isolated; Power Per Element: 62.5mW; Number of Contacts: 16; Supplier 1: Mouser; Manufacturer Part Number 1: YC248-JR-074K7L; Stock 1: 7603; Pricing 1: 1=0,31000, 10=0,19200, 100=0,06500, 1000=0,04400, 5000=0,03300, 10000=0,03100, 25000=0,02900, 50000=0,02800 (USD); RoHS: Yes; Mount: Surface Mount; Case/Package: 0616; Number of Pins: 16; Number of Terminals: 16; Case Code (Metric): 1640; Case Code (Imperial): 0616; Min Operating Temperature: -55°C; Max Operating Temperature: 155°C; Number of Elements: 8; Package Quantity: 1; Packaging: Tape and Reel; Military Standard: Not; Termination: Convex; Number of Circuits: 8; Length: 0.157inch; Height: 0.022inch; Width: 0.063inch; Terminal Pitch: 0.5mm; Depth: 1.6mm; Radiation Hardening: No; REACH SVHC: Unknown; Lead Free: Lead Free; ComponentLink1URL: https://datasheet.ciiva.com/8311/pyu-yc248-51-rohs-l-2-8311734.pdf?src-supplier=Avnet; ComponentLink1Description: https://datasheet.ciiva.com/8311/pyu-yc248-51-rohs-l-2-8311734.pdf?src-supplier=Avnet; ComponentLink2URL: https://datasheet.ciiva.com/28380/pyu-yc248-51-rohs-l-2-28380408.pdf?src-supplier=Avnet+Europe; ComponentLink2Description: https://datasheet.ciiva.com/28380/pyu-yc248-51-rohs-l-2-28380408.pdf?src-supplier=Avnet+Europe; ComponentLink3URL: https://datasheet.ciiva.com/2689/pyu-r-marking-2-2689433.pdf?src-supplier=Digi-Key; ComponentLink3Description: https://datasheet.ciiva.com/2689/pyu-r-marking-2-2689433.pdf?src-supplier=Digi-Key; ComponentLink4URL: https://datasheet.ciiva.com/2689/pyu-r-marking-2-2689434.pdf?src-supplier=Digi-Key; ComponentLink4Description: https://datasheet.ciiva.com/2689/pyu-r-marking-2-2689434.pdf?src-supplier=Digi-Key; ComponentLink5URL: https://datasheet.ciiva.com/2689/pyu-r-marking-2-2689435.pdf?src-supplier=Digi-Key; ComponentLink5Description: https://datasheet.ciiva.com/2689/pyu-r-marking-2-2689435.pdf?src-supplier=Digi-Key; ComponentLink6URL: https://datasheet.ciiva.com/8018/443139-8018062.pdf?src-supplier=Element14; ComponentLink6Description: https://datasheet.ciiva.com/8018/443139-8018062.pdf?src-supplier=Element14; ComponentLink7URL: https://datasheet.ciiva.com/8018/443139-8018063.pdf?src-supplier=Element14; ComponentLink7Description: https://datasheet.ciiva.com/8018/443139-8018063.pdf?src-supplier=Element14; Supplier Part Number 1: 603-YC248-JR-074K7L
R25 = RC0603FR-07100KL: RES SMD 100K OHM 1% 1/10W 0603; Manufacturer: Yageo; Power (Watts): 0.1W, 1/10W; Temperature Coefficient: ±100ppm/°C; Supplier 1: Digi-Key; Manufacturer Part Number: RC0603FR-07100KL; RoHS: RoHS Compliant; Category: Resistors; Stock 1: 6298016; Pricing 1: 1=0.08, 10=0.013, 100=0.005, 1000=0.00224, 2500=0.00195 (EUR); Packaging: Cut Tape (CT); Part Status: Active; Tolerance: ±1%; Composition: Thick Film; Features: Moisture Resistant; Operating Temperature: -55°C ~ 155°C; Package / Case: 0603 (1608 Metric); Supplier Device Package: 0603; Size / Dimension: 0.063" L x 0.032" W (1.60mm x 0.80mm); Height - Seated (Max): 0.022" (0.55mm); Failure Rate: -; ComponentLink1URL: http://www.yageo.com/documents/recent/PYu-RC_Group_51_RoHS_L_8.pdf; ComponentLink1Description: http://www.yageo.com/documents/recent/PYu-RC_Group_51_RoHS_L_8.pdf; Supplier Part Number 1: 311-100KHRCT-ND
R39 R40 R45 R50 R52 = RC0603FR-074K7L: RES SMD 4.7K OHM 1% 1/10W 0603; Manufacturer: Yageo; Resistance: 4.7kR; Temperature Coefficient: 100ppm/°C; Power Rating: 100mW; Voltage Rating (DC): 50V; Supplier 1: Mouser; Manufacturer Part Number: RC0603FR-074K7L; RoHS: Yes; Stock 1: 3735049; Pricing 1: 1 = 0,10000, 10 = 0,01800, 50 = 0,01800, 100 = 0,00600, 1000 = 0,00500, 10000 = 0,00300 (USD); Case/Package: 0603; Number of Pins: 2; Case Code (Imperial): 0603; Case Code (Metric): 1608; Min Operating Temperature: -55°C; Max Operating Temperature: 155°C; Tolerance: 1%; Composition: Thick Film; Packaging: Tape and Reel; Voltage Rating: 50V; Termination: SMD/SMT; Military Standard: Not; Length: 1.6mm; Height: 0.45mm; Width: 0.8mm; Depth: 0.8mm; Lead Pitch: 0.3mm; REACH SVHC: No SVHC; Lead Free: Lead Free; ComponentLink1URL: https://datasheet.ciiva.com/15189/getdatasheetpartid-422754-15189760.pdf?src-supplier=Verical; ComponentLink1Description: https://datasheet.ciiva.com/15189/getdatasheetpartid-422754-15189760.pdf?src-supplier=Verical; ComponentLink2URL: https://datasheet.ciiva.com/22747/443971-22747528.pdf?src-supplier=Element14; ComponentLink2Description: https://datasheet.ciiva.com/22747/443971-22747528.pdf?src-supplier=Element14; ComponentLink3URL: https://datasheet.ciiva.com/7660/38590-7660794.pdf?src-supplier=Element14; ComponentLink3Description: https://datasheet.ciiva.com/7660/38590-7660794.pdf?src-supplier=Element14; ComponentLink4URL: https://datasheet.ciiva.com/7746/1868787-7746365.pdf?src-supplier=Element14; ComponentLink4Description: https://datasheet.ciiva.com/7746/1868787-7746365.pdf?src-supplier=Element14; ComponentLink5URL: https://datasheet.ciiva.com/46440/1868787-46440909.pdf?src-supplier=Element14; ComponentLink5Description: https://datasheet.ciiva.com/46440/1868787-46440909.pdf?src-supplier=Element14; ComponentLink6URL: https://datasheet.ciiva.com/7746/1738695-7746366.pdf?src-supplier=Element14; ComponentLink6Description: https://datasheet.ciiva.com/7746/1738695-7746366.pdf?src-supplier=Element14; Supplier Part Number 1: 603-RC0603FR-074K7L
R42 = RC0603FR-0710R2L: RES SMD 10.2 OHM 1% 1/10W 0603; Manufacturer 1: Yageo; Resistance: 10.2R; Temperature Coefficient: 100ppm/°C; Power Rating: 100mW; Voltage Rating: 50V; Supplier 1: Mouser; Manufacturer Part Number 1: RC0603FR-0710R2L; Stock 1: 27905; Pricing 1: 1=0.10000, 10=0.01800, 50=0.01800, 100=0.00600, 1000=0.00500, 5000=0.00300, 10000=0.00300, 50000=0.00200 (USD); RoHS: Yes; Case/Package: 0603; Contact Plating: Tin; Case Code (Imperial): 0603; Case Code (Metric): 1608; Min Operating Temperature: -55°C; Max Operating Temperature: 155°C; Tolerance: 1%; Composition: Thick Film; Packaging: Tape and Reel; Termination: SMD/SMT; Military Standard: Not; Voltage Rating (DC): 50V; Length: 1.6mm; Height: 0.45mm; Width: 0.8mm; Depth: 0.8mm; Radiation Hardening: No; Lead Free: Lead Free; ComponentLink1URL: https://datasheet.ciiva.com/12575/rc0603-272842-12575110.pdf?src-supplier=Mouser; ComponentLink1Description: https://datasheet.ciiva.com/12575/rc0603-272842-12575110.pdf?src-supplier=Mouser; Supplier Part Number 1: 603-RC0603FR-0710R2L
TEST2 = PP_SMT_ROUND_2MM: Probe Pad, SMT, ROUND, 2.0MM
U1 = PI ZERO 2W: Comprar los pogo 575-906015  x 60 y los de los tornillos x4 710-9774025151R
U10 = TPS61169DCKR: IC LED DRVR RGLTR DIM 1.8A SC70; Manufacturer: Texas Instruments; Max Input Voltage: 5.5V; Number of Outputs: 1; Output Current: 400mA; Min Input Voltage: 2.7V; Max Output Current: 2.4A; Switching Frequency: 1.2MHz; Max Output Voltage: 38V; Nominal Input Voltage (DC): 3.6V; Topology: Boost; Dimming: PWM; Output Type: Frequency; Supplier 1: Mouser; Manufacturer Part Number: TPS61169DCKR; RoHS: Yes; Stock 1: 91313; Pricing 1: 1 = 0,90000, 10 = 0,77000, 50 = 0,77000, 100 = 0,58700, 1000 = 0,41000, 10000 = 0,35000 (USD); Mount: Surface Mount; Case/Package: SC; Number of Pins: 5; Weight: 0.000705oz; Contact Plating: Gold; Min Operating Temperature: -40°C; Max Operating Temperature: 85°C; Output Current per Channel: 1.8A; Package Quantity: 3000; Number of Channels: 1; Packaging: Tape and Reel; Max Supply Voltage: 5.5V; Frequency: 1.2MHz; Min Output Voltage: 2.7V; Output Voltage: 38V; Max Input Voltage (DC): 5.5V; Length: 2mm; Height: 1.1mm; Width: 1.25mm; REACH SVHC: No SVHC; Lead Free: Lead Free; ComponentLink1URL: http://www.ti.com/general/docs/lit/getliterature.tsp?genericPartNumber=TPS61169&&fileType=pdf&src-supplier=Element14; ComponentLink1Description: http://www.ti.com/general/docs/lit/getliterature.tsp?genericPartNumber=TPS61169&&fileType=pdf&src-supplier=Element14; ComponentLink2URL: http://www.ti.com/general/docs/lit/getliterature.tsp?genericPartNumber=TPS61169&amp;&amp;fileType=pdf&src-supplier=Farnell; ComponentLink2Description: http://www.ti.com/general/docs/lit/getliterature.tsp?genericPartNumber=TPS61169&amp;&amp;fileType=pdf&src-supplier=Farnell; ComponentLink3URL: http://www.ti.com/general/docs/lit/getliterature.tsp?genericPartNumber=TPS61169&&fileType=pdf&src-supplier=Avnet; ComponentLink3Description: http://www.ti.com/general/docs/lit/getliterature.tsp?genericPartNumber=TPS61169&&fileType=pdf&src-supplier=Avnet; ComponentLink4URL: http://www.ti.com/lit/ds/symlink/tps61169.pdf?src-supplier=Digi-Key; ComponentLink4Description: http://www.ti.com/lit/ds/symlink/tps61169.pdf?src-supplier=Digi-Key; ComponentLink5URL: http://www.ti.com/lit/gpn/tps61169?src-supplier=Mouser; ComponentLink5Description: http://www.ti.com/lit/gpn/tps61169?src-supplier=Mouser; ComponentLink6URL: http://www.ti.com/general/docs/lit/getliterature.tsp?genericPartNumber=TPS61169&&fileType=pdf&src-supplier=Avnet+Asia; ComponentLink6Description: http://www.ti.com/general/docs/lit/getliterature.tsp?genericPartNumber=TPS61169&&fileType=pdf&src-supplier=Avnet+Asia

## Sheet [07] - USB-hub.SchDoc
size A3; DocumentNumber: 9; SheetNumber: 8; SheetTotal: 9
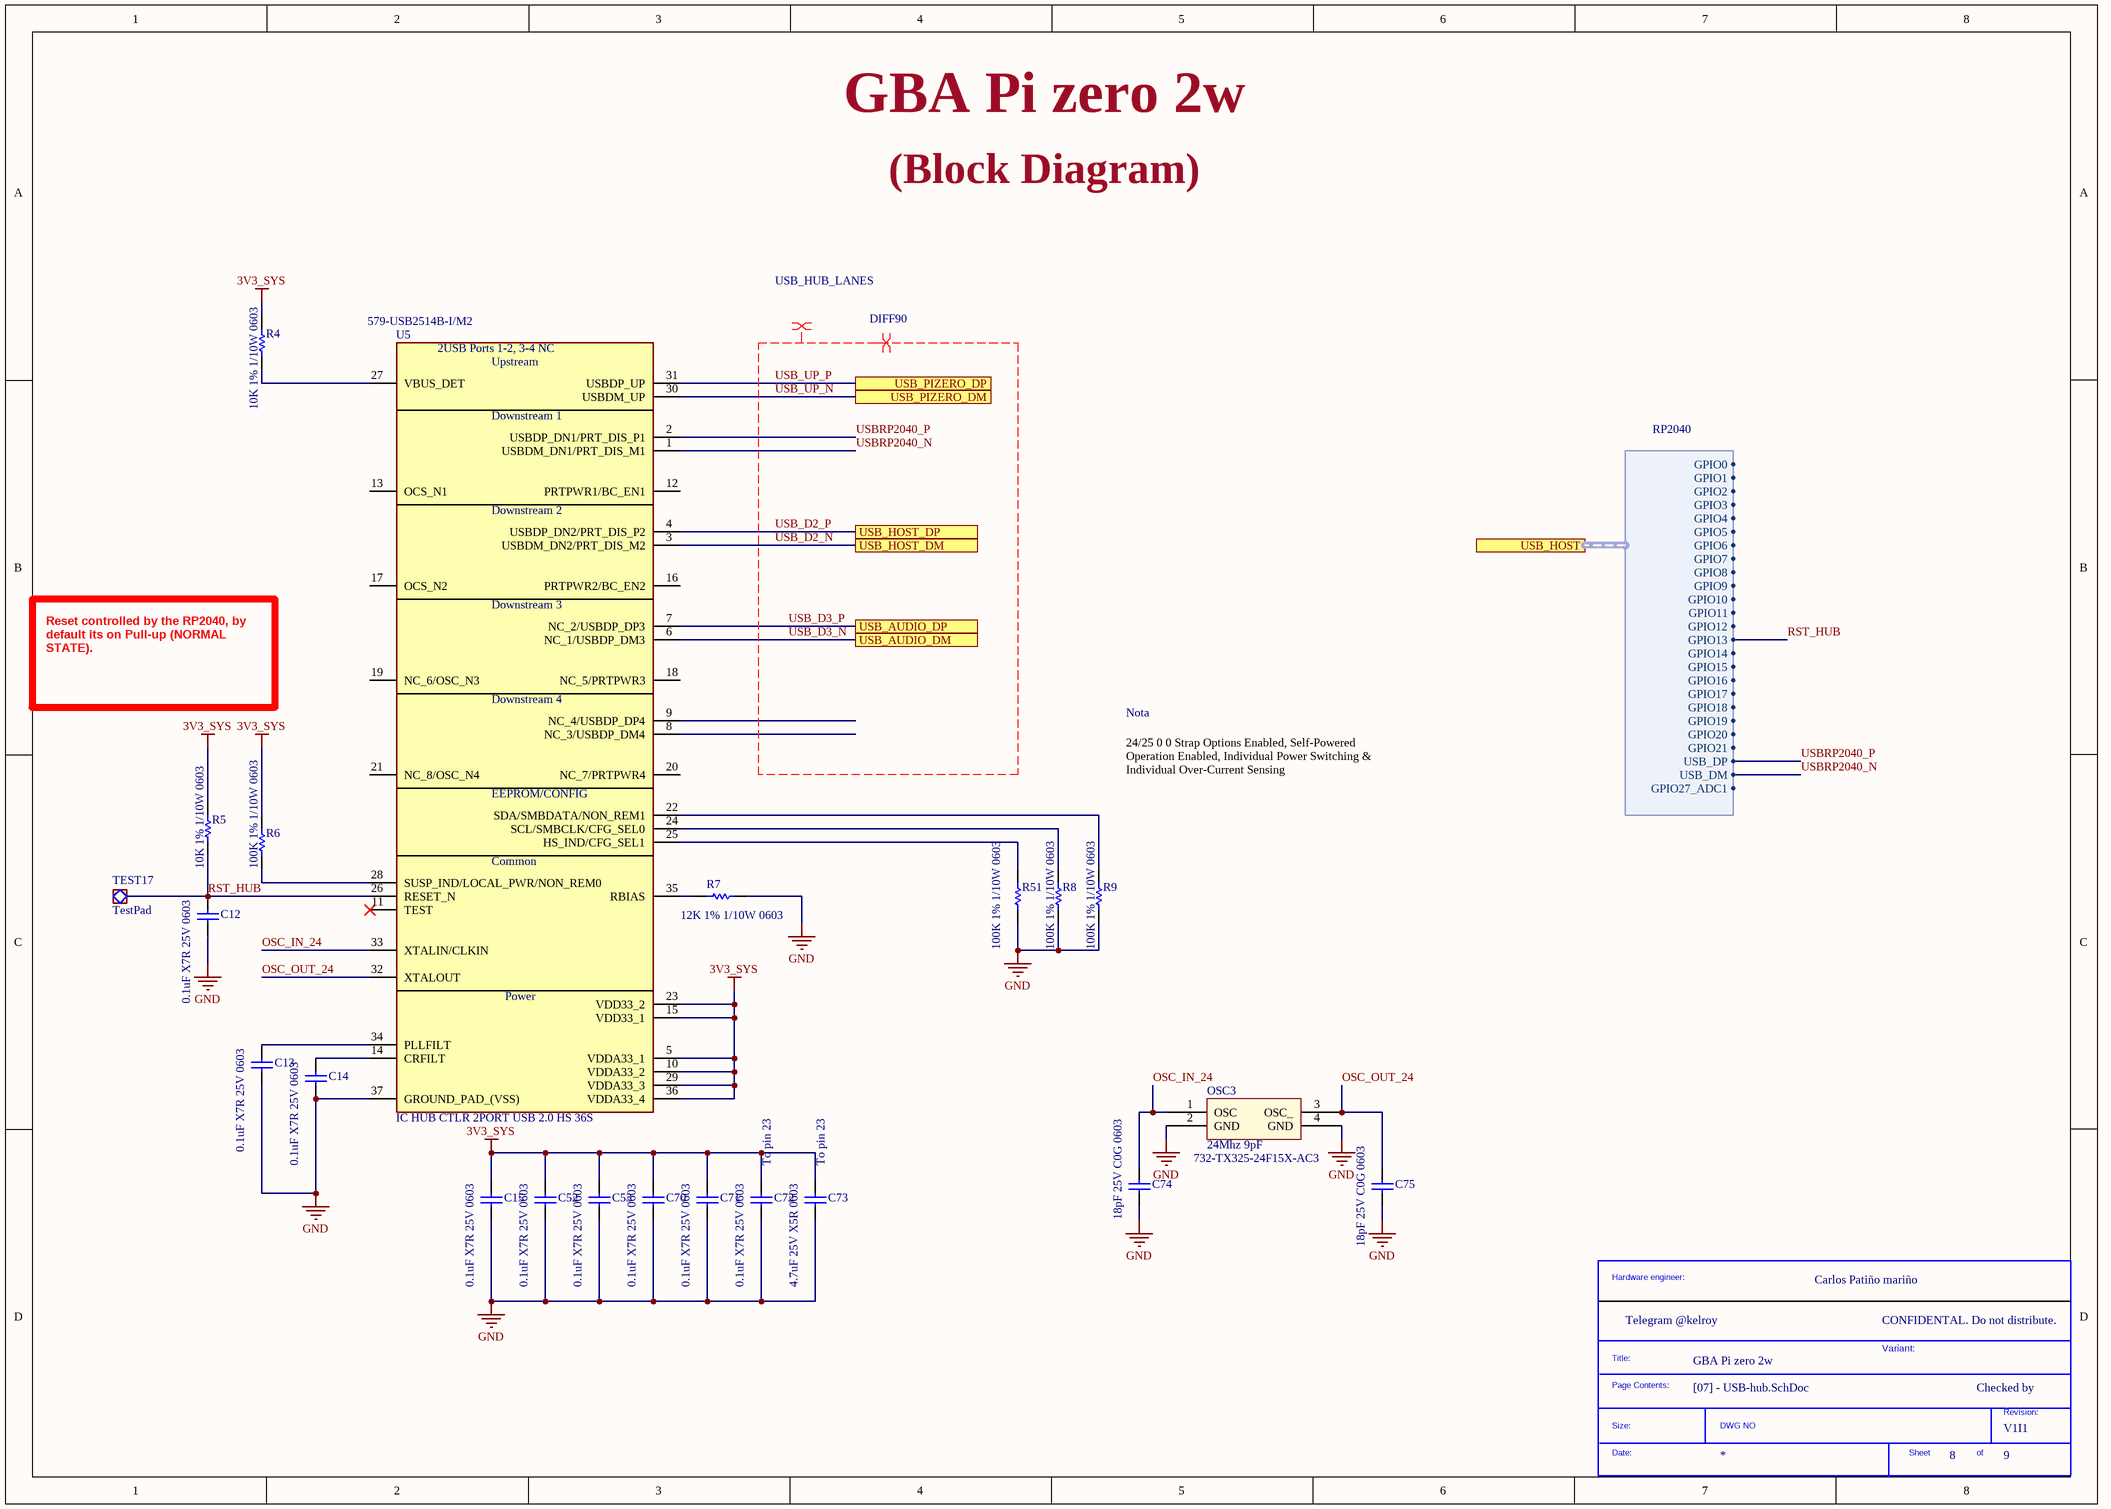
[diagram p5: [07] - USB-hub.SchDoc]

### Parts
(Parts that share a designator on the sheet are numbered #1, #2 ... from top to bottom, then left to right.)
*#6  SDTitleBlock  (value not drawn)  (graphical)
C12  0.1uF X7R 25V 0603  [C 0603/1608]
C13  0.1uF X7R 25V 0603  [C 0603/1608]
C14  0.1uF X7R 25V 0603  [C 0603/1608]
C15  0.1uF X7R 25V 0603  [C 0603/1608]
C52  0.1uF X7R 25V 0603  [C 0603/1608]
C53  0.1uF X7R 25V 0603  [C 0603/1608]
C70  0.1uF X7R 25V 0603  [C 0603/1608]
C71  0.1uF X7R 25V 0603  [C 0603/1608]
C72  0.1uF X7R 25V 0603  [C 0603/1608]
C73  4.7uF 25V X5R 0603  [C 0603/1608]
C74  18pF 25V C0G 0603  [C 0603/1608]
C75  18pF 25V C0G 0603  [C 0603/1608]
OSC3  24Mhz 9pF  Supplier Part Number 1: 732-TX325-24F15X-AC3  [3.2 mm x 2.5 mm(SMD 3225]
R4  10K 1% 1/10W 0603  [R 0603/1608]
R5  10K 1% 1/10W 0603  [R 0603/1608]
R6  100K 1% 1/10W 0603  [R 0603/1608]
R7  12K 1% 1/10W 0603  [R 0603/1608]
R8  100K 1% 1/10W 0603  [R 0603/1608]
R9  100K 1% 1/10W 0603  [R 0603/1608]
R51  100K 1% 1/10W 0603  [R 0603/1608]
TEST17  TestPad  [TestPad]  (no BOM)
U5  IC HUB CTLR 2PORT USB 2.0 HS 36S  Supplier Part Number 1: 579-USB2514B-I/M2  [QFN50P600X600X100-37N-D]

### Ports
USB_AUDIO_DM, USB_AUDIO_DP, USB_HOST (harness RP2040), USB_HOST_DM, USB_HOST_DP, USB_PIZERO_DM, USB_PIZERO_DP

### Harnesses
RP2040: GPIO0, GPIO1, GPIO2, GPIO3, USB_DP, USB_DM, GPIO27_ADC1, GPIO4, GPIO5, GPIO6, GPIO7, GPIO8, GPIO9, GPIO10, GPIO11, GPIO12, GPIO13, GPIO14, GPIO15, GPIO16, GPIO17, GPIO18, GPIO19, GPIO20, GPIO21

### Nets
3V3_SYS: C15.1 C52.1 C53.1 C70.1 C71.1 C72.1 C73.1 R4.2 R5.2 R6.2 U5.5(VDDA33_1) U5.10(VDDA33_2) U5.15(VDD33_1) U5.23(VDD33_2) U5.29(VDDA33_3) U5.36(VDDA33_4)
GND: C12.2 C13.2 C14.2 C15.2 C52.2 C53.2 C70.2 C71.2 C72.2 C73.2 C74.2 C75.2 OSC3.2(GND) OSC3.4(GND) R7.2 R8.1 R9.1 R51.1 U5.37(GROUND_PAD_(VSS))  [project net CSN]
OSC_IN_24: C74.1 OSC3.1(OSC) U5.33(XTALIN/CLKIN)
OSC_OUT_24: C75.1 OSC3.3(OSC_) U5.32(XTALOUT)
RST_HUB: C12.1 R5.1 TEST17.1 U5.26(RESET_N) ; port USB_HOST.GPIO13  [project net RPI_GPIO13]
USB_D2_N: U5.3(USBDM_DN2/PRT_DIS_M2) ; port USB_HOST_DM
USB_D2_P: U5.4(USBDP_DN2/PRT_DIS_P2) ; port USB_HOST_DP
USB_D3_N: U5.6(NC_1/USBDP_DM3) ; port USB_AUDIO_DM  [project net POST_DR_DAC_N]
USB_D3_P: U5.7(NC_2/USBDP_DP3) ; port USB_AUDIO_DP  [project net POST_DR_DAC_P]
USB_UP_N: U5.30(USBDM_UP) ; port USB_PIZERO_DM  [project net RPI_USB_N]
USB_UP_P: U5.31(USBDP_UP) ; port USB_PIZERO_DP  [project net RPI_USB_P]
USBRP2040_N: U5.1(USBDM_DN1/PRT_DIS_M1) ; port USB_HOST.USB_DM  [project net USB_OUT_PICO_N]
USBRP2040_P: U5.2(USBDP_DN1/PRT_DIS_P1) ; port USB_HOST.USB_DP  [project net USB_OUT_PICO_P]
NetC13_1: C13.1 U5.34(PLLFILT)
NetC14_1: C14.1 U5.14(CRFILT)
NetR4_1: R4.1 U5.27(VBUS_DET)
NetR6_1: R6.1 U5.28(SUSP_IND/LOCAL_PWR/NON_REM0)
NetR7_1: R7.1 U5.35(RBIAS)
NetR8_2: R8.2 U5.24(SCL/SMBCLK/CFG_SEL0)
NetR9_2: R9.2 U5.22(SDA/SMBDATA/NON_REM1)
NetR51_2: R51.2 U5.25(HS_IND/CFG_SEL1)

Not connected (* = marked no-connect by the designer): U5 8(NC_3/USBDP_DM4) 9(NC_4/USBDP_DP4) 11(TEST)* 12(PRTPWR1/BC_EN1) 13(OCS_N1) 16(PRTPWR2/BC_EN2) 17(OCS_N2) 18(NC_5/PRTPWR3) 19(NC_6/OSC_N3) 20(NC_7/PRTPWR4) 21(NC_8/OSC_N4)

### Layout directives
differential pair; net class DIFF90: USB_D2_N, USB_D2_P, USB_D3_N, USB_D3_P, USB_UP_N, USB_UP_P, USBRP2040_N, USBRP2040_P
net class USB_HUB_LANES; rule Differential Pairs Routing [Pref Gap = 0.18mm    Min Gap  = 0.18mm    Max Gap  = 0.18mmPref Width = 0.15mm    Min Width  = 0.15mm    Max Width  = 0.15mm]: USB_D2_N, USB_D2_P, USB_D3_N, USB_D3_P, USB_UP_N, USB_UP_P, USBRP2040_N, USBRP2040_P

### Notes on the sheet
- (Block Diagram)
- Reset controlled by the RP2040, by default its on Pull-up (NORMAL STATE).
- Nota
- 24/25 0 0 Strap Options Enabled, Self-Powered Operation Enabled, Individual Power Switching & Individual Over-Current Sensing
- (near C72) To pin 23
- (near C73) To pin 23
- (near C75) CLOCKS (CPU & PCIE)
- Carlos Patiño mariño
- CONFIDENTAL. Do not distribute.
- Variant:
- Checked by
- (in symbol SDTitleBlock) Hardware engineer:; Title:; Page Contents:; Revision:; Size:; DWG NO; Date:; Sheet; of
- (in symbol USB2512B/M2) 2USB Ports 1-2, 3-4 NC; Upstream; Downstream 1; Downstream 2; Downstream 3; Downstream 4; EEPROM/CONFIG; Common; Power

### Library data of the parts
C12-C15 C52 C53 C70-C72 = 885012206071: WURTH ELEKTRONIK         885012206071             SMD Multilayer Ceramic Capacitor, 0603 [1608 Metric], 0.1 F, 25 V,  10%, X7R, WCAP-CSGP Series; Manufacturer: Wurth Electronics; Capacitance: 100nF; Supplier 1: Mouser; Manufacturer Part Number: 885012206071; Stock 1: 202580; Pricing 1: 1=0.1, 10=0.046, 50=0.046, 100=0.041, 1000=0.036, 10000=0.036 (USD); Mount: Surface Mount; Case/Package: 0603; Case Code (Metric): 1608; Case Code (Imperial): 0603; Min Operating Temperature: -55°C; Max Operating Temperature: 125°C; Packaging: Cut Tape; Voltage Rating: 25V; Dielectric: X7R; Tolerance: 10%; Voltage Rating (DC): 25V; Length: 0.063inch; Width: 0.031inch; Thickness: 0.037inch; REACH SVHC: Unknown; Supplier Part Number 1: 710-885012206071
C73 = TMK107BBJ475MA-T: as C41 on sheet [04] - Display & Pi Zero & USB Host; Supplier 1: Mouser; Manufacturer Part Number 1: TMK107BBJ475MA-T; Stock 1: 7442; Pricing 1: 1=0.31000, 10=0.15200, 50=0.15200, 100=0.10900, 1000=0.08300, 10000=0.06500 (USD); RoHS: No; Supplier Part Number 1: 963-TMK107BBJ475MA-T
C74 C75 = CC0603JRNPO8BN180: Cap Ceramic 18pF 25V C0G 5% SMD 0603 125C Paper T/R; Manufacturer 1: Yageo; Supplier 1: Mouser; Manufacturer Part Number 1: CC0603JRNPO8BN180; Stock 1: 521; Pricing 1: 1=0.10000, 10=0.04200, 50=0.04200, 100=0.01900, 1000=0.01500, 10000=0.01000 (USD); RoHS: Yes; Mount: Surface Mount; Case/Package: 0603; Weight: 7.1E-05oz; Case Code (Imperial): 0603; Case Code (Metric): 1608; Min Operating Temperature: -55°C; Max Operating Temperature: 125°C; Capacitance: 18pF; Voltage Rating (DC): 25V; Tolerance: 5%; Packaging: Tape and Reel; Dielectric: C0G; Voltage Rating: 25V; Termination: SMD/SMT; Composition: Ceramic; Length: 0.063inch; Width: 0.031inch; Thickness: 0.035inch; ComponentLink1URL: https://datasheet.ciiva.com/13263/upy-gp-np0-16v-to-50v-8-3714-13263805.pdf?src-supplier=Mouser; ComponentLink1Description: https://datasheet.ciiva.com/13263/upy-gp-np0-16v-to-50v-8-3714-13263805.pdf?src-supplier=Mouser; Supplier Part Number 1: 603-CC603JRNPO8BN180
OSC3 = TSX-322524.0000MF15X-AC3: CRYSTAL 24.0000MHZ 9PF SMD; Manufacturer 1: Epson; Frequency Tolerance: 10ppm; ESR (Equivalent Series Resistance): 40R; Frequency Stability: 15ppm; Supplier 1: Mouser; Manufacturer Part Number 1: TSX-322524.0000MF15X-AC3; Stock 1: 68237; Pricing 1: 1=0.34000, 10=0.27500, 50=0.24800, 100=0.22000, 500=0.19300, 1000=0.17600, 2000=0.16500, 5000=0.16000, 10000=0.15400 (USD); RoHS: Yes; Mount: Surface Mount; Case/Package: SMD/SMT; Weight: 0.000564oz; Min Operating Temperature: -40°C; Max Operating Temperature: 85°C; Package Quantity: 250; Frequency: 24MHz; Load Capacitance: 9pF; Packaging: Tape and Reel; Tolerance: 10ppm; Termination: SMD/SMT; Length: 0.126inch; Height: 0.024inch; Width: 0.098inch; Lead Free: Lead Free; ComponentLink1URL: https://support.epson.biz/td/api/doc_check.php?dl=brief_TSX-3225&lang=en&src-supplier=Digi-Key; ComponentLink1Description: https://support.epson.biz/td/api/doc_check.php?dl=brief_TSX-3225&lang=en&src-supplier=Digi-Key; ComponentLink2URL: http://www5.epsondevice.com/en/products/crystal_unit/tsx3225.html#?src-supplier=Mouser; ComponentLink2Description: http://www5.epsondevice.com/en/products/crystal_unit/tsx3225.html#?src-supplier=Mouser; ComponentLink3URL: https://www5.epsondevice.com/en/information/support/pdf/june_2018_psc_masterbook.pdf?src-supplier=Digi-Key; ComponentLink3Description: https://www5.epsondevice.com/en/information/support/pdf/june_2018_psc_masterbook.pdf?src-supplier=Digi-Key
R4 R5 = RC0603FR-0710KL: RES SMD 10K OHM 1% 1/10W 0603; Manufacturer: Yageo; Power (Watts): 0.1W, 1/10W; Temperature Coefficient: ±100ppm/°C; Supplier 1: Digi-Key; Manufacturer Part Number: RC0603FR-0710KL; RoHS: RoHS Compliant; Category: Resistors; Stock 1: 47851285; Pricing 1: 1=0.08, 10=0.013, 100=0.005, 1000=0.00224, 2500=0.00195 (EUR); Packaging: Cut Tape (CT); Part Status: Active; Tolerance: ±1%; Composition: Thick Film; Features: Moisture Resistant; Operating Temperature: -55°C ~ 155°C; Package / Case: 0603 (1608 Metric); Supplier Device Package: 0603; Size / Dimension: 0.063" L x 0.032" W (1.60mm x 0.80mm); Height - Seated (Max): 0.022" (0.55mm); Failure Rate: -; ComponentLink1URL: http://www.yageo.com/documents/recent/PYu-RC_Group_51_RoHS_L_8.pdf; ComponentLink1Description: http://www.yageo.com/documents/recent/PYu-RC_Group_51_RoHS_L_8.pdf; Supplier Part Number 1: 311-10.0KHRCT-ND
R6 R8 R9 R51 = RC0603FR-07100KL: as R25 on sheet [04] - Display & Pi Zero & USB Host; Supplier 1: Digi-Key; Manufacturer Part Number: RC0603FR-07100KL; RoHS: RoHS Compliant; Category: Resistors; Stock 1: 6298016; Pricing 1: 1=0.08, 10=0.013, 100=0.005, 1000=0.00224, 2500=0.00195 (EUR); Packaging: Cut Tape (CT); Part Status: Active; Tolerance: ±1%; Composition: Thick Film; Features: Moisture Resistant; Operating Temperature: -55°C ~ 155°C; Package / Case: 0603 (1608 Metric); Supplier Device Package: 0603; Size / Dimension: 0.063" L x 0.032" W (1.60mm x 0.80mm); Height - Seated (Max): 0.022" (0.55mm); Failure Rate: -; ComponentLink1URL: http://www.yageo.com/documents/recent/PYu-RC_Group_51_RoHS_L_8.pdf; ComponentLink1Description: http://www.yageo.com/documents/recent/PYu-RC_Group_51_RoHS_L_8.pdf; Supplier Part Number 1: 311-100KHRCT-ND
R7 = RC0603FR-0712KL: RES SMD 12K OHM 1% 1/10W 0603; Manufacturer: Yageo; Resistance: 12kR; Power Rating: 100mW; Voltage Rating (DC): 50V; Temperature Coefficient: 100ppm/°C; Supplier 1: Mouser; Manufacturer Part Number: RC0603FR-0712KL; Stock 1: 535615; Pricing 1: 1=0.1, 10=0.018, 50=0.018, 100=0.006, 1000=0.005, 10000=0.003 (USD); Case/Package: 0603; Number of Pins: 2; Case Code (Imperial): 0603; Case Code (Metric): 1608; Min Operating Temperature: -55°C; Max Operating Temperature: 155°C; Tolerance: 1%; Packaging: Tape and Reel; Voltage Rating: 50V; Package Quantity: 1; Termination: SMD/SMT; Composition: Thick Film; Number of Terminations: 2; Military Standard: Not; Max Power Dissipation: 100mW; Features: Moisture Resistant; Length: 0.063inch; Height: 0.022inch; Width: 0.031inch; Depth: 0.8mm; REACH SVHC: No SVHC; Lead Free: Lead Free; ComponentLink1URL: http://documents.rs-components.com/techlib://itc_doclist_GB.htm?stockno=5049218; ComponentLink1Description: http://documents.rs-components.com/techlib://itc_doclist_GB.htm?stockno=5049218; ComponentLink2URL: http://www.yageo.com/documents/recent/PYu-RC_Group_51_RoHS_L_10.pdf; ComponentLink2Description: http://www.yageo.com/documents/recent/PYu-RC_Group_51_RoHS_L_10.pdf; ComponentLink3URL: http://www.farnell.com/datasheets/1868787.pdf; ComponentLink3Description: http://www.farnell.com/datasheets/1868787.pdf; ComponentLink4URL: http://www.farnell.com/datasheets/443971.pdf; ComponentLink4Description: http://www.farnell.com/datasheets/443971.pdf; ComponentLink5URL: http://www.yageo.com/documents/recent/PYu-RC_Group_51_RoHS_L_9.pdf; ComponentLink5Description: http://www.yageo.com/documents/recent/PYu-RC_Group_51_RoHS_L_9.pdf; Supplier Part Number 1: 603-RC0603FR-0712KL
TEST17 = PP_SMT_ROUND_2MM: Probe Pad, SMT, ROUND, 2.0MM
U5 = USB2512B/M2: Manufacturer 1: Microchip; Manufacturer Part Number 1: USB2514B-I/M2; Operating Supply Current: 70mA; Min Supply Voltage: 3V; Max Supply Voltage: 3.6V; Data Rate: 480Mbps; Number of Ports: 4; USB Standard: USB 2.0; ComponentLink1URL: http://www.farnell.com/datasheets/2032129.pdf?src-supplier=Farnell; ComponentLink1Description: http://www.farnell.com/datasheets/2032129.pdf?src-supplier=Farnell; ComponentLink2URL: http://ww1.microchip.com/downloads/en/DeviceDoc/00001692B.pdf?src-supplier=Avnet; ComponentLink2Description: http://ww1.microchip.com/downloads/en/DeviceDoc/00001692B.pdf?src-supplier=Avnet; ComponentLink3URL: http://www.microchip.com/mymicrochip/filehandler.aspx?ddocname=en562310&src-supplier=Digi-Key; ComponentLink3Description: http://www.microchip.com/mymicrochip/filehandler.aspx?ddocname=en562310&src-supplier=Digi-Key; Supplier 1: Mouser; Stock 1: 2735; Pricing 1: 1=3.02000, 10=2.98000, 25=2.52000, 50=2.52000, 100=2.43000, 1000=2.43000, 10000=2.27000 (USD); RoHS: Yes; Number of Pins: 36; Min Operating Temperature: -40°C; Max Operating Temperature: 85°C; Packaging: Tray; Interface: USB; REACH SVHC: No SVHC; Lead Free: Lead Free; ComponentLink4URL: http://www.farnell.com/datasheets/2032129.pdf?src-supplier=Element14; ComponentLink4Description: http://www.farnell.com/datasheets/2032129.pdf?src-supplier=Element14